# EasyEDA Pro project 六轴机械臂.eprj

# Schematic 拓展板

## Sheets
1 控制: Board Name: 拓展板; Create Date: 2025-06-17; Page Name: 控制; Project Name: 六轴机械臂; Schematic Name: 拓展板; Update Date: 2025-06-18; Add into BOM: yes; Company: 嘉立创EDA; Convert to PCB: yes; Page Size: A4; Version: V1.0
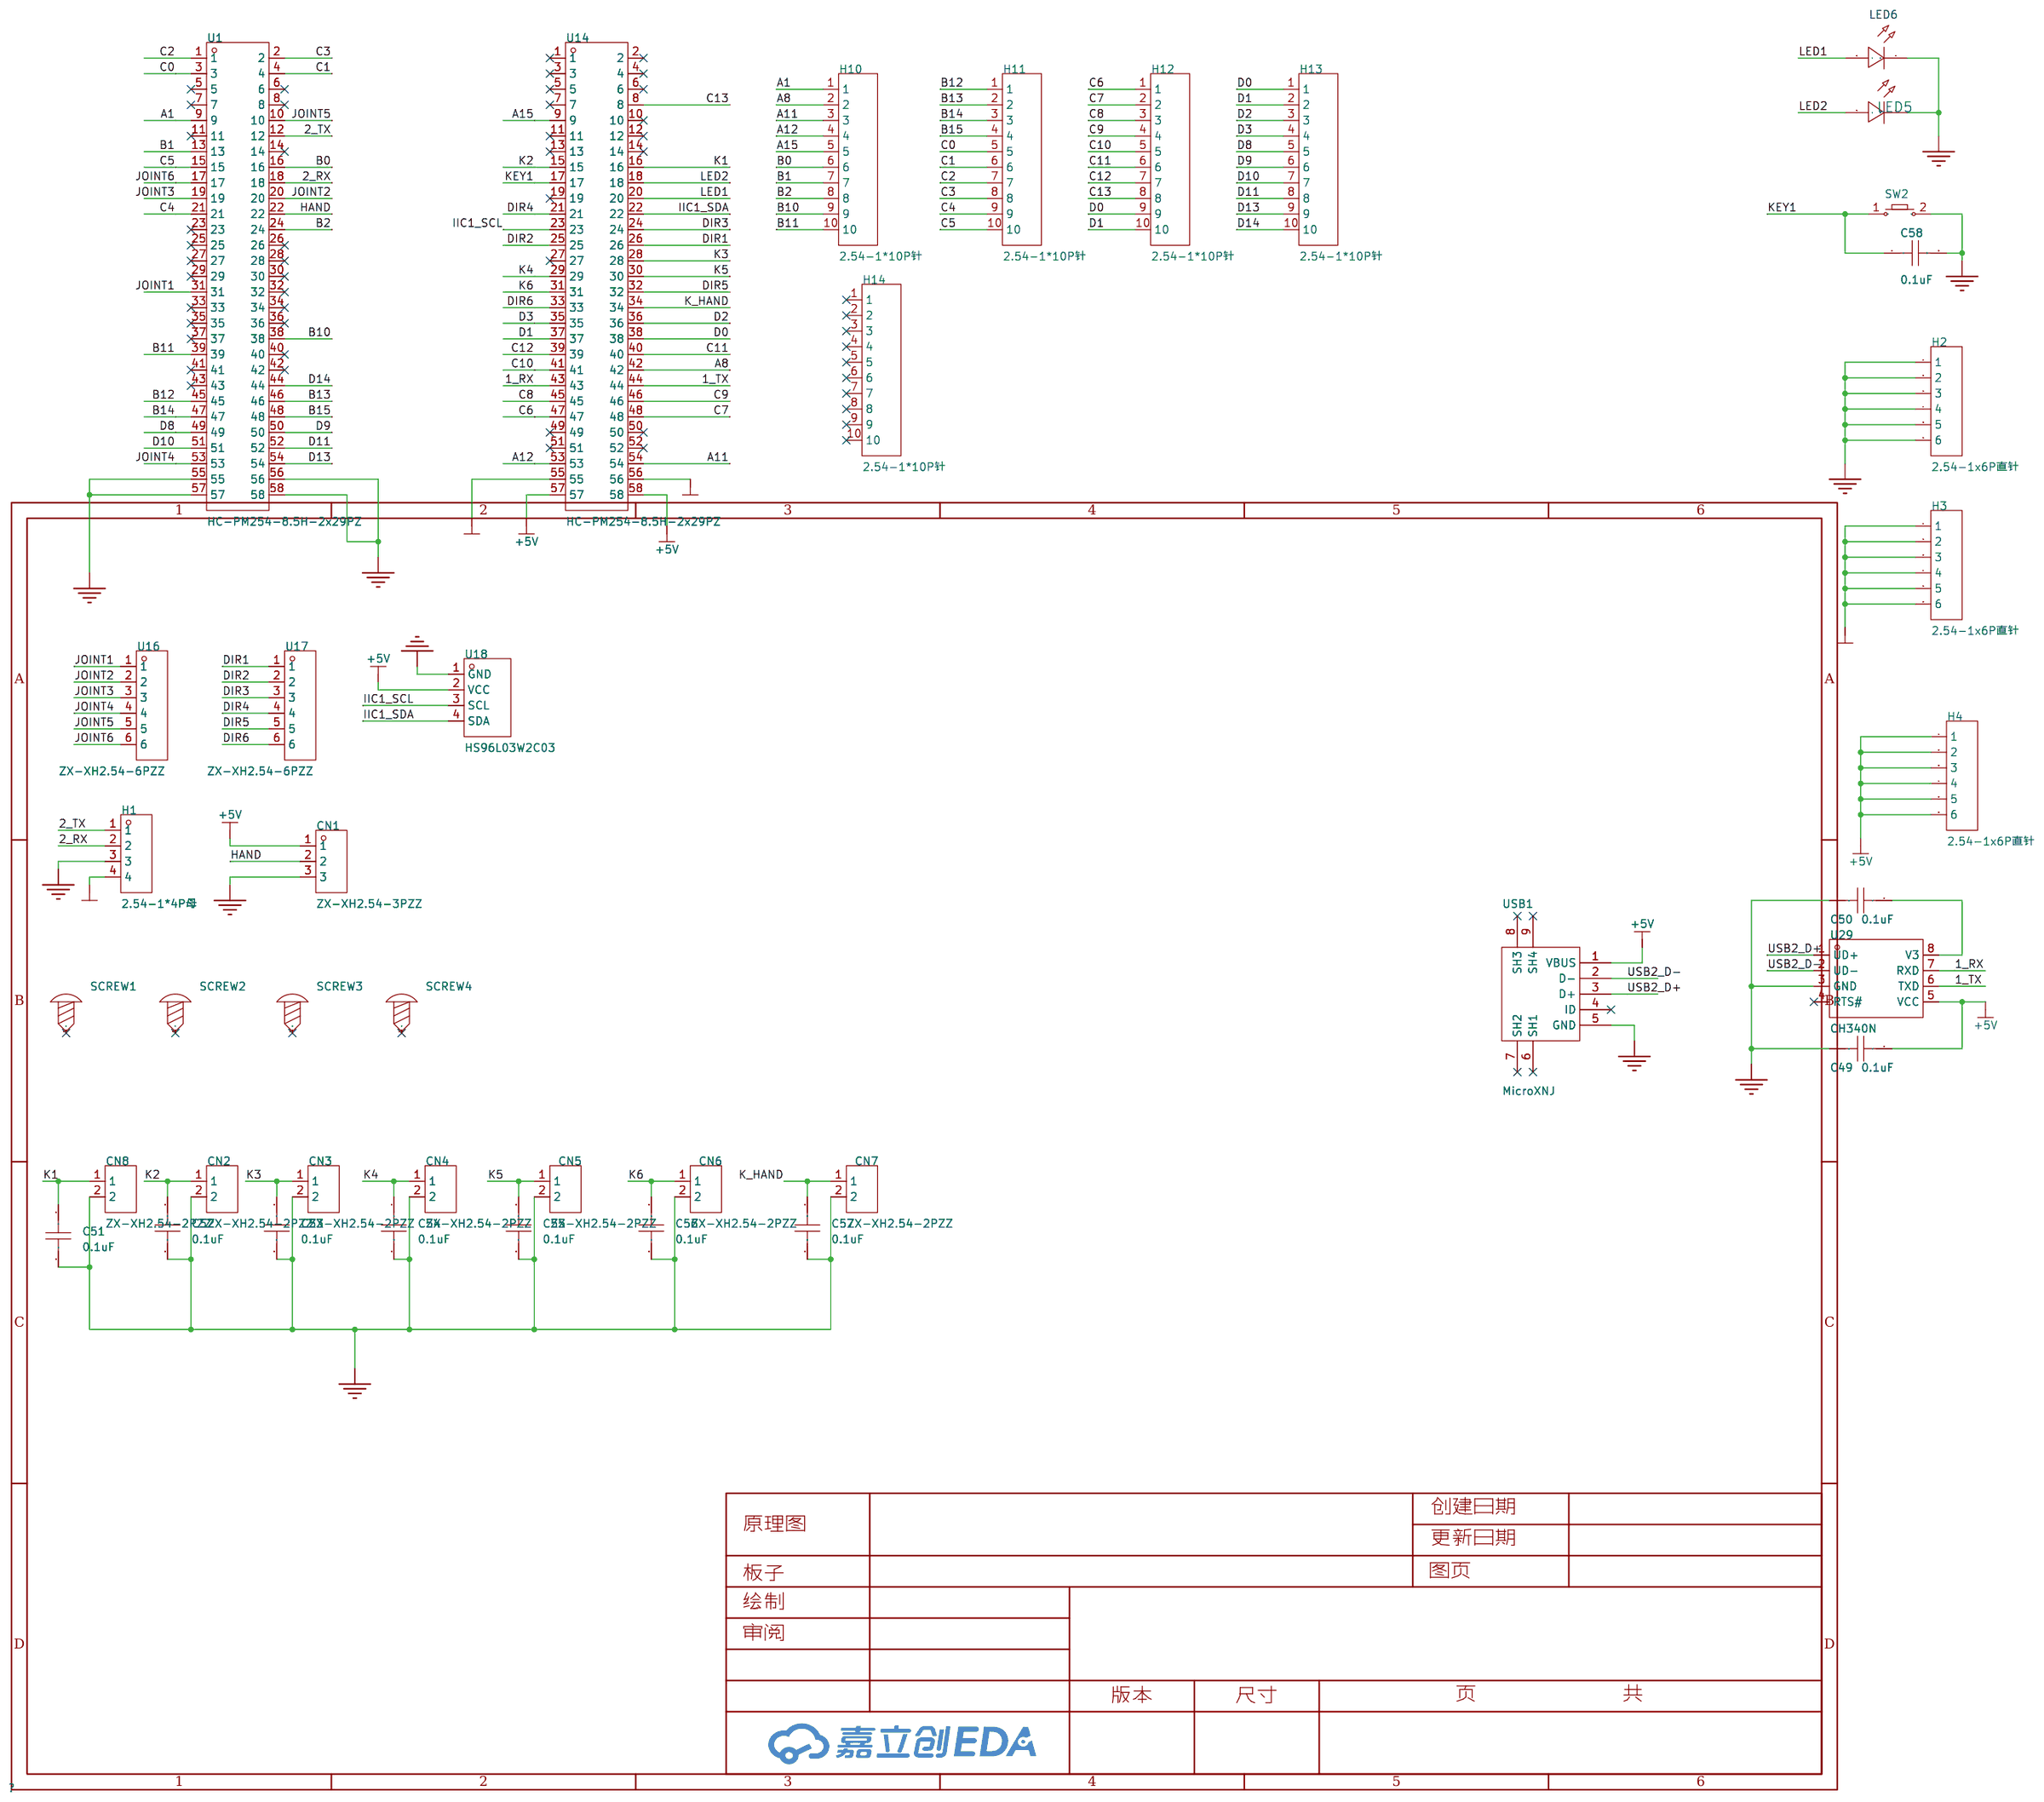
[diagram p0: 控制]
2 电源: Page Name: 电源; Update Date: 2025-06-17
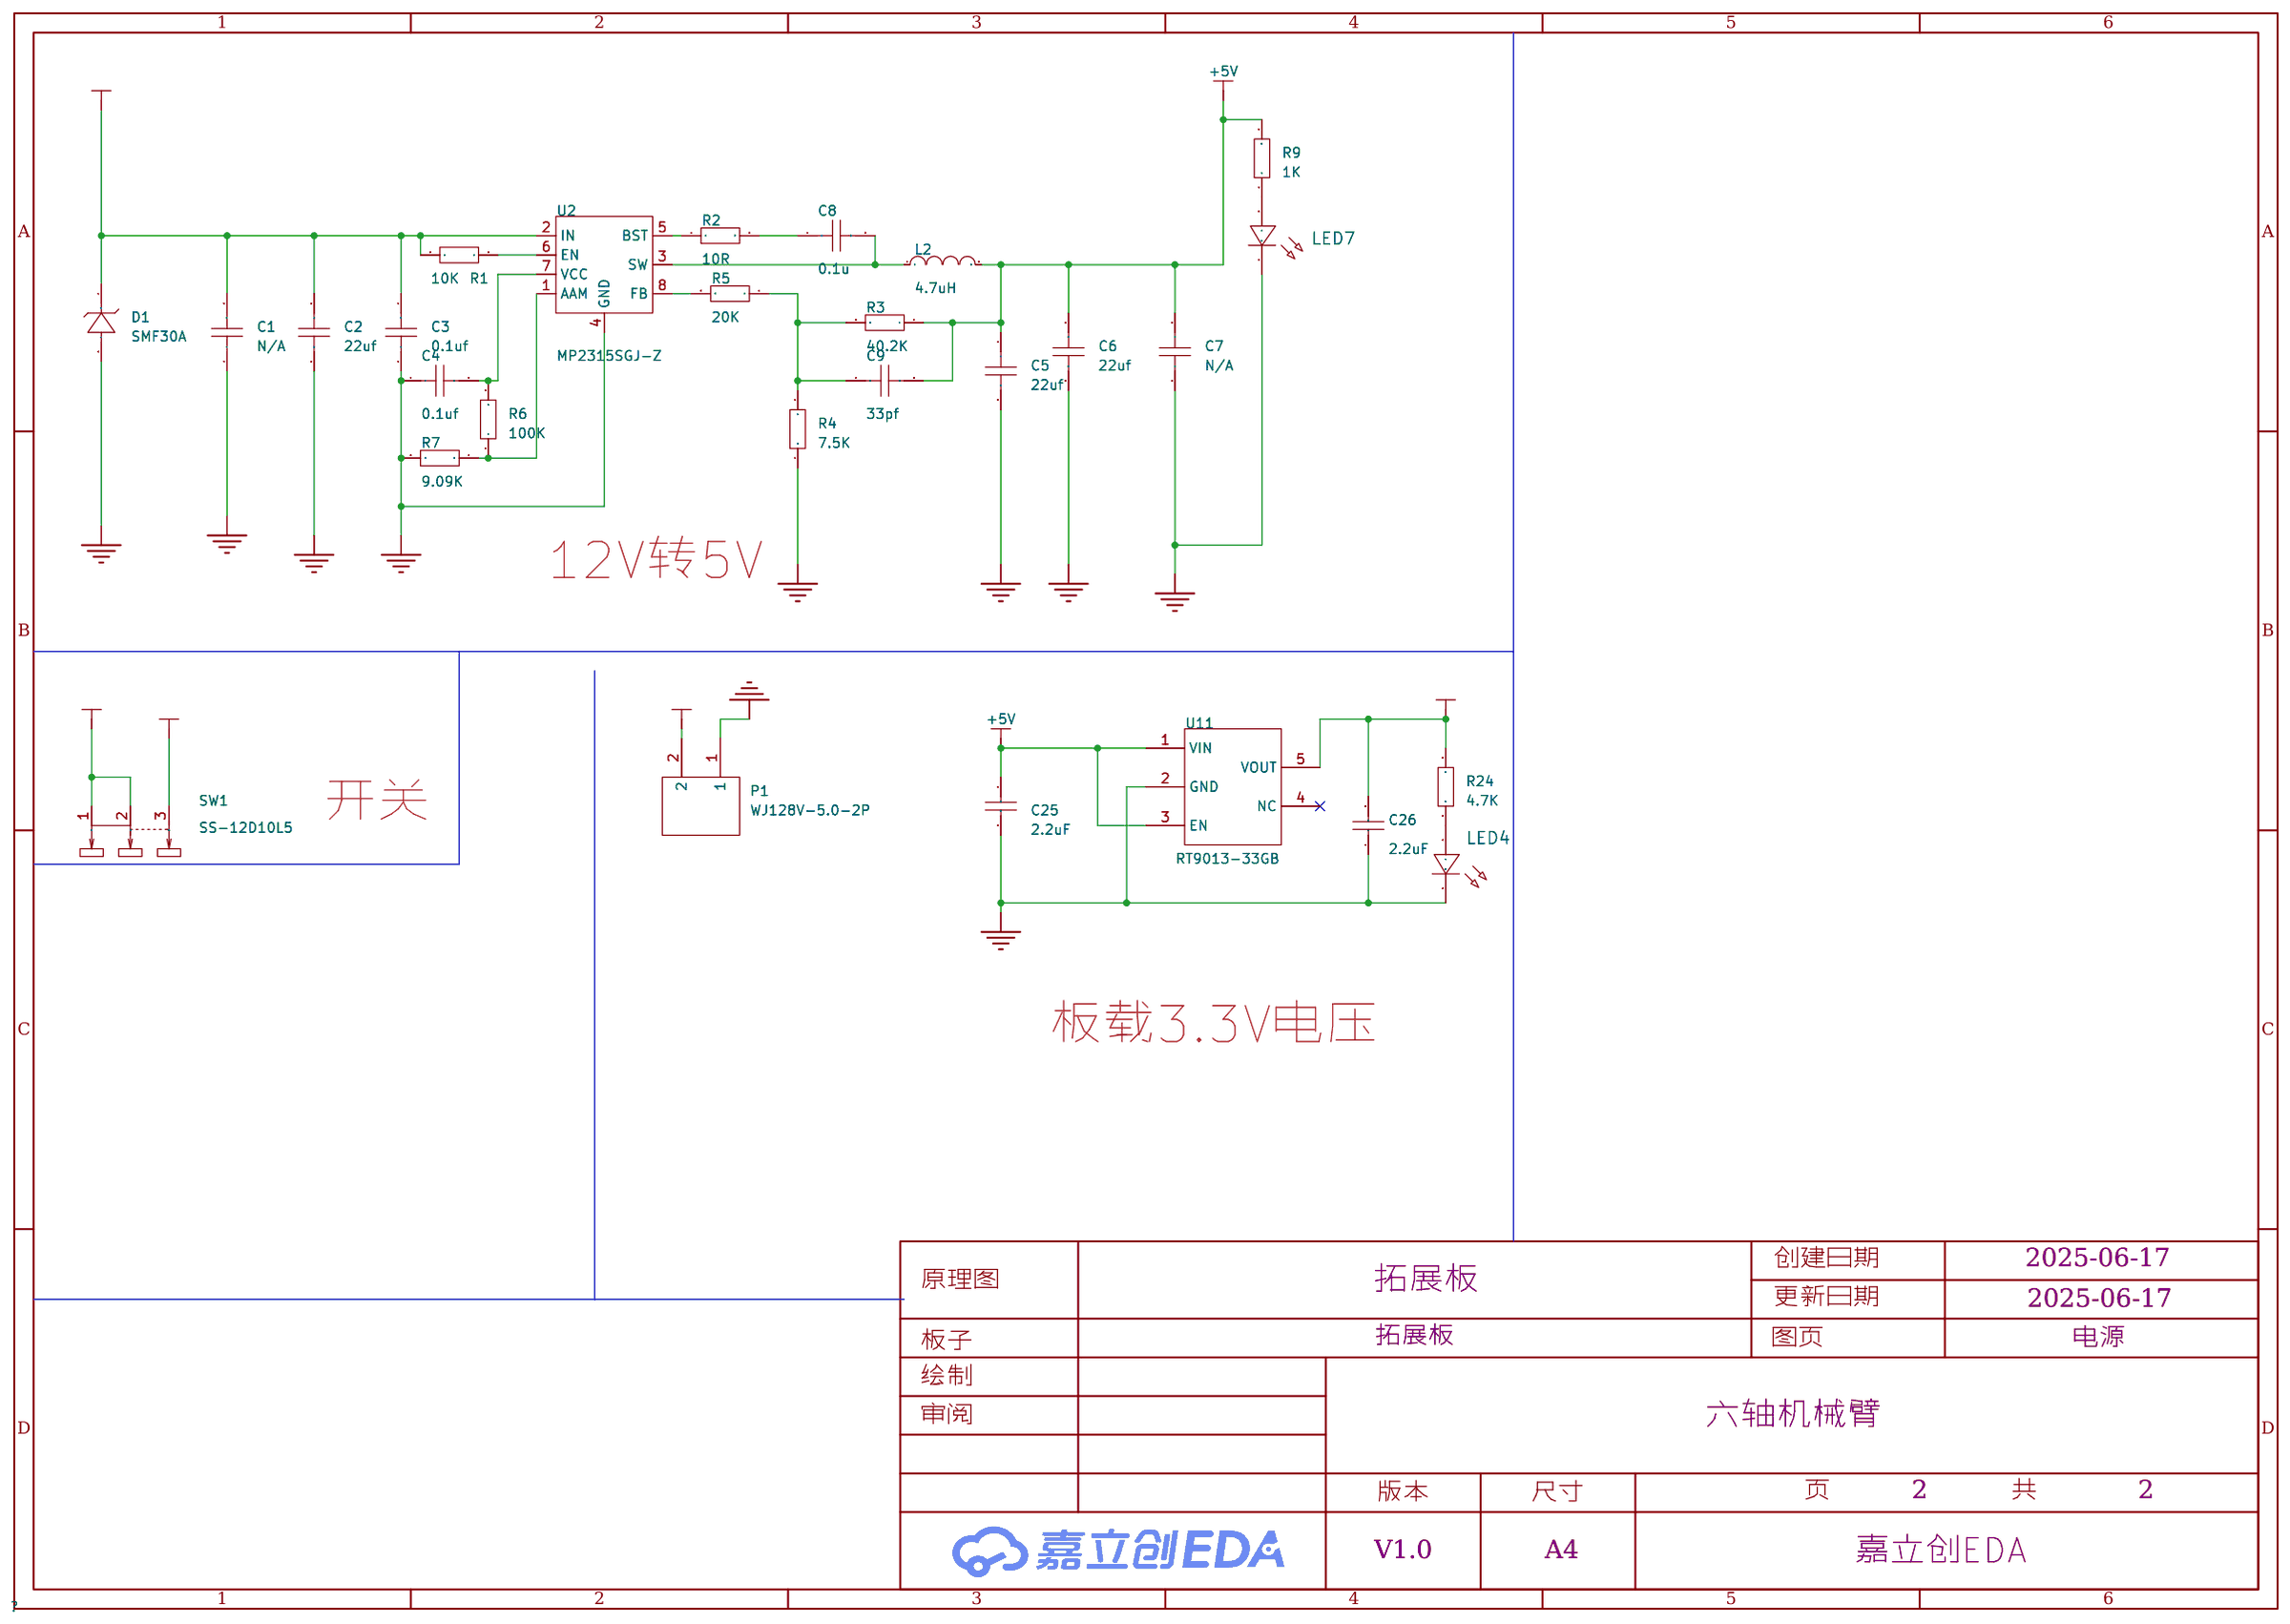
[diagram p1: 电源]

## Parts
sheet 控制
C49  0.1uF  [C0603]
C50  0.1uF  [C0603]
C51  0.1uF  [C0603]
C52  0.1uF  [C0603]
C53  0.1uF  [C0603]
C54  0.1uF  [C0603]
C55  0.1uF  [C0603]
C56  0.1uF  [C0603]
C57  0.1uF  [C0603]
C58  0.1uF  [C0603]
CN1  ZX-XH2.54-3PZZ  [CONN-TH_3P-P2.54_2501S-3P]
CN2  ZX-XH2.54-2PZZ  [CONN-TH_2P-P2.50_HX25003-2A]
CN3  ZX-XH2.54-2PZZ  [CONN-TH_2P-P2.50_HX25003-2A]
CN4  ZX-XH2.54-2PZZ  [CONN-TH_2P-P2.50_HX25003-2A]
CN5  ZX-XH2.54-2PZZ  [CONN-TH_2P-P2.50_HX25003-2A]
CN6  ZX-XH2.54-2PZZ  [CONN-TH_2P-P2.50_HX25003-2A]
CN7  ZX-XH2.54-2PZZ  [CONN-TH_2P-P2.50_HX25003-2A]
CN8  ZX-XH2.54-2PZZ  [CONN-TH_2P-P2.50_HX25003-2A]
H1  2.54-1*4P母  [HDR-TH_4P-P2.54-V-F]
H2  2.54-1x6P直针  [HDR-TH_6P-P2.54-V-M-1]
H3  2.54-1x6P直针  [HDR-TH_6P-P2.54-V-M-1]
H4  2.54-1x6P直针  [HDR-TH_6P-P2.54-V-M-1]
H10  2.54-1*10P针  [HDR-TH_10P-P2.54-V-M-1]
H11  2.54-1*10P针  [HDR-TH_10P-P2.54-V-M-1]
H12  2.54-1*10P针  [HDR-TH_10P-P2.54-V-M-1]
H13  2.54-1*10P针  [HDR-TH_10P-P2.54-V-M-1]
H14  2.54-1*10P针  [HDR-TH_10P-P2.54-V-M-1]
LED5  -  [LED_0603]
LED6  -  [LED_0603]
SCREW1  -  [M2螺丝]
SCREW2  -  [M2螺丝]
SCREW3  -  [M2螺丝]
SCREW4  -  [M2螺丝]
SW2  -  [Key_SMD_3x4x2]
U1  HC-PM254-8.5H-2x29PZ  [HDR-TH_58P-P2.54-V-F-R2-C29-S2.54]
U14  HC-PM254-8.5H-2x29PZ  [HDR-TH_58P-P2.54-V-F-R2-C29-S2.54]
U16  ZX-XH2.54-6PZZ  [CONN-TH_6P-P2.50_ZX-XH2.54-6PZZ]
U17  ZX-XH2.54-6PZZ  [CONN-TH_6P-P2.50_ZX-XH2.54-6PZZ]
U18  HS96L03W2C03  [OLED-TH_L27.8-W27.2-P2.54_C9900033791]
U29  CH340N  [SOP-8_L4.9-W3.9-P1.27-LS6.0-BL]
USB1  MicroXNJ  [MICRO-USB-SMD_MICROXNJ]
sheet 电源
C1  N/A  [C0603]
C2  22uf  [C0603]
C3  0.1uf  [C0603]
C4  0.1uf  [C0603]
C5  22uf  [C0603]
C6  22uf  [C0603]
C7  N/A  [C0603]
C8  0.1u  [C0603]
C9  33pf  [C0603]
C25  2.2uF  [C0603]
C26  2.2uF  [C0603]
D1  SMF30A  [SOD-123FL_L2.7-W1.8-LS3.8-RD]
L2  4.7uH  [IND-SMD_L5.4-W5.2_FXL0530]
LED4  -  [LED_0603]
LED7  -  [LED_0603]
P1  WJ128V-5.0-2P  [CONN-TH_2P-P5.00_WJ128V-5.0-2P]
R1  10K  [R0603]
R2  10R  [R0603]
R3  40.2K  [R0603]
R4  7.5K  [R0603]
R5  20K  [R0603]
R6  100K  [R0603]
R7  9.09K  [R0603]
R9  1K  [R0603]
R24  4.7K  [R0603]
SW1  SS-12D10L5  [SW-TH_SS-12D10L5]
U2  MP2315SGJ-Z  [TSOT-23-8_L2.9-W1.6-P0.65-LS2.8-BL]
U11  RT9013-33GB  [SOT-23-5_L3.0-W1.7-P0.95-LS2.8-BL]

## Library data of the parts
C1-C9 C49-C58 = CAP_0603: Supplier Footprint: 0603
CN1 = ZX-XH2.54-3PZZ: LCSC Part Name: 1x3P 间距:2.5mm 直插 系列:XH; Supplier Part: C7429633; Manufacturer: Megastar(兆星); Supplier Footprint: 插件,P=2.5mm; JLCPCB Part Class: 扩展库; Datasheet: https://atta.szlcsc.com/upload/public/pdf/source/20230619/AE17037A2CFDBE8D9CBA775D61AD0A84.pdf; Supplier: LCSC; Pins Structure: 1x3P; Pitch: 2.5mm; Mounting Type: 直插; Reference Series: XH; Number of Pins: 3P; Number of Rows: 1; Number of PINs Per Row: 3; Rated Current: 3A; Contact Material: 黄铜; Contact Plating: 锡; Operating Temperature: -25℃~+85℃; Rated Voltage (Max): 250V; Plastic Material: PA66; Flame Retardant Rating: UL94V-0; Color: 白色; Z-Height of the Board: 7mm; X-Length of Bottom Edge on Board (Spacing Line): 10mm; Y-Width of Bottom Edge on Board: 5.9mm
CN2-CN8 = ZX-XH2.54-2PZZ: LCSC Part Name: 1x2P 间距:2.5mm 直插 系列:XH; Supplier Part: C7429632; Manufacturer: Megastar(兆星); Supplier Footprint: 插件,P=2.5mm; JLCPCB Part Class: 扩展库; Datasheet: https://atta.szlcsc.com/upload/public/pdf/source/20230619/19BA6947230AA44A04D3EDD65E618FD0.pdf; Supplier: LCSC; Pins Structure: 1x2P; Pitch: 2.5mm; Mounting Type: 直插; Reference Series: XH; Number of Pins: 2P; Number of Rows: 1; Number of PINs Per Row: 2; Rated Current: 3A; Contact Material: 黄铜; Contact Plating: 锡; Operating Temperature: -25℃~+85℃; Rated Voltage (Max): 250V; Plastic Material: PA66; Flame Retardant Rating: UL94V-0; Color: 白色; Z-Height of the Board: 7mm; X-Length of Bottom Edge on Board (Spacing Line): 7.5mm; Y-Width of Bottom Edge on Board: 5.9mm
H1 = 2.54-1*4P母: LCSC Part Name: 间距:2.54mm 1x4P 直插; Supplier Part: C2718488; Manufacturer: BOOMELE(博穆精密); Supplier Footprint: 插件,P=2.54mm; JLCPCB Part Class: 扩展库; Datasheet: https://atta.szlcsc.com/upload/public/pdf/source/20210301/C2718488_F4427B881E42CAA8DDB0B1C12B3A522C.pdf; Supplier: LCSC; Holes Structure: 1x4P; Pitch: 2.54mm; Circular Hole / Square Hole: 方孔; Mounting Type: 直插; Number of Rows: 单排; Number of Holes: 4P; Current Rating (Max): 3A; Holes Direction: 顶部; Contact Material: 青铜; Operating Temperature Range: -40℃~+105℃
H2-H4 = 2.54-1x6P直针: LCSC Part Name: 1x6P 间距:2.54mm 方针 直插; Supplier Part: C37208; Manufacturer: BOOMELE(博穆精密); Supplier Footprint: 插件,P=2.54mm; JLCPCB Part Class: 扩展库; Datasheet: https://atta.szlcsc.com/upload/public/pdf/source/20250115/42A019761A40C8B839643401D8CA5A96.pdf; Supplier: LCSC; Pin Structure: 1x6P; Pitch: 2.54mm; Circluar Pins/Square Pins: 方针; Mounting Type: 直插; Number of Rows: 单排; Number of Pins: 6P; Current Rating: 3A; Contact Material: 黄铜; Operating Temperature: -40℃~+105℃; Color: 黑色
H10-H14 = 2.54-1*10P针: LCSC Part Name: 1x10P 间距:2.54mm 方针 直插; Supplier Part: C57369; Manufacturer: BOOMELE(博穆精密); Supplier Footprint: 插件,P=2.54mm; JLCPCB Part Class: 扩展库; Datasheet: https://atta.szlcsc.com/upload/public/pdf/source/20151109/1457707572883.pdf; Supplier: LCSC; Pin Structure: 1x10P; Pitch: 2.54mm; Circluar Pins/Square Pins: 方针; Mounting Type: 直插; Number of Rows: 单排; Number of Pins: 10P; Current Rating: 3A; Operating Temperature: -40℃~+105℃; Color: 黑色
LED4 LED5 LED7 = LED_0603-R: Supplier Footprint: 0603
LED6 = LED_0603-G: Supplier Footprint: 0603
SCREW1-SCREW4 = M2螺丝: Supplier Footprint: 插件
SW2 = Key_SMD_3x4x2: Supplier Footprint: SMD
U1 U14 = HC-PM254-8.5H-2x29PZ: LCSC Part Name: 间距2.54mm 2x29Pin 直插 PC3.0 H8.5; Supplier Part: C41376169; Manufacturer: HC(虹成电子); Supplier Footprint: 插件,P=2.54mm; Datasheet: https://atta.szlcsc.com/upload/public/pdf/source/20250106/4E42E502EF17F4DFEB61B7A0CE1BBEC6.pdf; Supplier: LCSC; Holes Structure: 2x29P; Pitch: 2.54mm; Row Spacing: 2.54mm; Circular Hole / Square Hole: 方孔; Mounting Type: 直插; Number of Rows: 双排; Number of Positions: 58P; Current Rating: 3A; Holes Direction: 顶部; Insulation Height: 8.5mm; Contact Material: 黄铜; Contact Plating: 金; Operating Temperature: -40℃~+105℃; PIN Length: 3mm
U16 U17 = ZX-XH2.54-6PZZ: LCSC Part Name: 1x6P 间距:2.5mm 直插 系列:XH; Supplier Part: C7429636; Manufacturer: Megastar(兆星); Supplier Footprint: 插件,P=2.5mm; JLCPCB Part Class: 扩展库; Datasheet: https://atta.szlcsc.com/upload/public/pdf/source/20230619/1243AD0A516E39CD3D274D8985780568.pdf; Supplier: LCSC; Pins Structure: 1x6P; Pitch: 2.5mm; Mounting Type: 直插; Reference Series: XH; Number of Pins: 6P; Number of Rows: 1; Number of PINs Per Row: 6; Rated Current: 3A; Contact Material: 黄铜; Contact Plating: 锡; Operating Temperature: -25℃~+85℃; Rated Voltage (Max): 250V; Plastic Material: PA66; Flame Retardant Rating: UL94V-0; Color: 白色; Z-Height of the Board: 7mm; X-Length of Bottom Edge on Board (Spacing Line): 17.5mm; Y-Width of Bottom Edge on Board: 5.9mm
U18 = HS96L03W2C03: LCSC Part Name: 0.96寸OLED显示屏窄白光IIC; Supplier Part: C5248080; Manufacturer: HS(汉昇); JLCPCB Part Class: 扩展库; Datasheet: https://atta.szlcsc.com/upload/public/pdf/source/20230627/763D01F79A90007632F098068C7C8AD9.pdf; Supplier: LCSC; Main Control Chip: SSD1315; Interface Type: I2C; Size: 0.96; Pixel Resolution: 128x64; Operating Temperature: -40℃~+70℃
U29 = CH340N: 应用功能:USB转串口;接口协议:USB 2.0;通道数:1;数据速率:2Mbps;; LCSC Part Name: USB2.0芯片CH340; Supplier Part: C2977777; Manufacturer: WCH(南京沁恒); Supplier Footprint: SOP-8; JLCPCB Part Class: Extended Part; Datasheet: https://atta.szlcsc.com/upload/public/pdf/source/20240313/115CDE92081B1D6CB446704AD5D0F5F2.pdf; Supplier: LCSC; Applications Function: USB转串口; Protocol: USB 2.0; Number of Channels: 1; Voltage - Supply: 3.3V；5V; Data Rate: 2Mbps; Operating Temperature: -20℃~+70℃
USB1 = MicroXNJ: LCSC Part Name: Micro-B 母 卧贴; Supplier Part: C404969; Manufacturer: SHOU HAN(首韩); Supplier Footprint: SMD; JLCPCB Part Class: 扩展库; Datasheet: https://atta.szlcsc.com/upload/public/pdf/source/20220415/2494EDFF499AF6F852F7C820374B6AF3.pdf; Supplier: LCSC; Connector Type: Micro-B; Standard: USB 2.0; Gender: 母; Mounting Style: 卧贴; Number of Contacts: 5P; Number of Ports: 1; Current Rating - Power (Max): 1.8A; Operating Temperature Range: -20℃~+85℃; Rated Voltage (Max): 30V; Connect-Disconnect Life: 5千次; Core Colour: 黑色
C25 C26 = 0603B104K500NT: 容值:100nF;精度:±10%;额定电压:50V;材质(温度系数):X7R;; LCSC Part Name: 100nF ±10% 50V; Supplier Part: C30926; Manufacturer: FH(风华); Supplier Footprint: 0603; JLCPCB Part Class: 扩展库; Datasheet: https://atta.szlcsc.com/upload/public/pdf/source/20170923/C30926_1506149436298988724.pdf; Supplier: LCSC; Tolerance: ±10%; Voltage Rated: 50V; Temperature Coefficient: X7R
D1 = SMF30A: 极性:单向;反向截止电压(Vrwm):30V;击穿电压(最小值):33.3V;击穿电压(最大值):36.8V;反向漏电流(Ir):1μA;峰值脉冲电流(Ipp)@10/1000μs:4.1A;最大钳位电压:48.4V;峰值脉冲功率(Ppp)@10/1000μs:200W;; LCSC Part Name: 单向 30V 200W; Supplier Part: C353290; Manufacturer: 晶导微电子; Supplier Footprint: SOD-123FL; JLCPCB Part Class: Extended Part; Datasheet: https://atta.szlcsc.com/upload/public/pdf/source/20201106/C438024_76561727B84E8C9F41A4B4461A8AA838.pdf; Supplier: LCSC; Polarity: 单向; Reverse Stand-Off Voltage (Vrwm): 30V; Breakdown Voltage (Min): 33.3V; Breakdown Voltage (Max): 36.8V; Reverse Leakage Current (Ir): 1μA; Peak Pulse Current (Ipp)@10/1000μs: 4.1A; Maximum Clamping Voltage: 48.4V; Peak Pulse Power Dissipation (Ppp)@10/1000μs: 200W
L2 = FXL0530-4R7-M: LCSC Part Name: 4.7uH ±20% 5A; Supplier Part: C177246; Manufacturer: cjiang(长江微电); Supplier Footprint: SMD,5.2x5.4mm; JLCPCB Part Class: Extended Part; Datasheet: https://atta.szlcsc.com/upload/public/pdf/source/20240426/3189EA8206330E2108542F9E34E540E7.pdf; Supplier: LCSC; Tolerance: ±20%; Rated Current: 4.5A; Saturation Current (Isat): 5A; DC Resistance (DCR): 60mΩ; Type: 一体成型电感
P1 = WJ128V-5.0-2P: 结构:1x2P;间距:5mm;颜色:绿色;安装方式:直插;额定电流:20A;额定电压:250V;排数:1;线规 - AWG:12~22;线规 - 平方毫米:2.5;每排PIN数:2;工作温度范围:-40℃~+105℃;; LCSC Part Name: 5mm 1x2P 排数:1 每排P数:2 直插; Supplier Part: C8269; Manufacturer: KANGNEX(康奈克斯电气); Supplier Footprint: 插件,P=5mm; JLCPCB Part Class: 扩展库; Datasheet: https://atta.szlcsc.com/upload/public/pdf/source/20191225/C8269_1FF44D6D2E83DB14A7CA266A410FD9AD.pdf; Supplier: LCSC; Structure: 1x2P; Pitch: 5mm; Color: 绿色; Mounting Style: 直插; Current Rating (Max): 20A; Voltage Rating (Max): 250V; Number of Pins: 2P; Number of Rows: 1; Wire Gauge - AWG: 12~22; Wire Gauge - mm2: 2.5; Number of PINs Per Row: 2; Operating Temperature Range: -40℃~+105℃
R1-R7 R9 R24 = Res_0603: Supplier Footprint: 0603
SW1 = SS-12D10L5: 电路结构:单刀双掷;安装方式:直插;开关颜色:黑色;额定电流(DC):3A;额定电压(DC):125V;额定电流(AC):3A;额定电压(AC):125V;机械寿命:1万次;; LCSC Part Name: 柄长5mm 直插双档 滑动开关; Supplier Part: C319012; Manufacturer: XKB Connectivity(中国星坤); Supplier Footprint: 插件; JLCPCB Part Class: 扩展库; Datasheet: https://atta.szlcsc.com/upload/public/pdf/source/20211009/D6412F37AABE6F9459A6EE7FA4DAEADB.pdf; Supplier: LCSC; Circuit: 单刀双掷; Actuator Style: 矩形柱状; Pin Style: PC引脚; Switch Length: 13mm; Switch Width: 6.8mm; Switch Height: 6.4mm; Mounting Style: 直插; Actuator Color: 黑色; Current Rating (DC): 3A; Voltage Rating (DC): 125V; Current Rating (AC): 3A; Voltage Rating (AC): 125V; Mechanical Life: 1万次; Operating Temperature: -40℃~+85℃
U2 = MP2315SGJ-Z: 功能类型:降压型;输出类型:固定;工作电压:4.5V~24V;输出电压:800mV~22.8V;输出电流:3A;; LCSC Part Name: 3A、24V、500kHz高效同步降压转换器; Supplier Part: C3031493; Manufacturer: MPS(芯源); Supplier Footprint: TSOT-23-8; JLCPCB Part Class: 扩展库; Datasheet: https://atta.szlcsc.com/upload/public/pdf/source/20250306/6947E43CF096EA5EF0087E1884EF0D8F.pdf; Supplier: LCSC; Function: 降压型; Output Type: 固定; Voltage - Supply: 4.5V~24V; Output Voltage: 800mV~22.8V; Output Current: 3A; Frequency - Switching: 500kHz; Operating Temperature: -40℃~+125℃; Synchronous Rectifier: 是; Number of Outputs: 1; Topology: 降压式; Quiescent Current: 120uA; Switch tube (built-in/external): 内置
U11 = RT9013-33GB: 输出类型:固定;最大输入电压:5.5V;输出电压:3.3V;输出电流:500mA;电源纹波抑制比(PSRR):50dB@(10kHz);输出极性:正极;; LCSC Part Name: 输入5.5V 输出3.3V 500mA; Supplier Part: C47773; Manufacturer: RICHTEK(立锜); Supplier Footprint: SOT-23-5; JLCPCB Part Class: Extended Part; Datasheet: https://atta.szlcsc.com/upload/public/pdf/source/20150504/1457707282459.pdf; Supplier: LCSC; Output Type: 固定; Output Polarity: 正极; Number of Outputs: 1; Maximum Input Voltage: 5.5V; Output Voltage: 3.3V; Dropout Voltage: 400mV@(500mA); Quiescent Current (Ground Current): 50uA; Output Current: 500mA; Power Supply Rejection Ratio (PSRR): 50dB@(10kHz); Feature: 低ESR；防静电保护；热保护(TSD)；过流保护(OCP)；带使能; Operating Temperature: -40℃~+85℃; standby current: 50uA

## Nets
3.3V: C26.2 H1.4 H3.1 H3.2 H3.3 H3.4 H3.5 H3.6 R24.2 U11.5(VOUT) U14.55 U14.56
12V_IN: P1.2 SW1.3
12V_OUT: C1.2 C2.1 C3.1 D1.1(K) R1.1 SW1.1 SW1.2 U2.2(IN)
+5V: C5.1 C6.1 C7.1 C9.2 C25.2 C49.1 CN1.1 H4.1 H4.2 H4.3 H4.4 H4.5 H4.6 L2.2 R3.1 R9.2 U11.1(VIN) U11.3(EN) U14.57 U14.58 U18.2(VCC) U29.5(VCC) USB1.1(VBUS)
GND: C1.1 C2.2 C3.2 C4.1 C5.2 C6.2 C7.2 C25.1 C26.1 C49.2 C50.2 C51.2 C52.2 C53.2 C54.2 C55.2 C56.2 C57.2 C58.2 CN1.3 CN2.2 CN3.2 CN4.2 CN5.2 CN6.2 CN7.2 CN8.2 D1.2(A) H1.3 H2.1 H2.2 H2.3 H2.4 H2.5 H2.6 LED4.1(C) LED5.1(C) LED6.1(C) LED7.1(C) P1.1 R4.1 R7.2 SW2.2 U1.55 U1.56 U1.57 U1.58 U2.4(GND) U11.2(GND) U18.1(GND) U29.3(GND) USB1.5(GND)
1_RX: U14.43 U29.7(RXD)
1_TX: U14.44 U29.6(TXD)
2_RX: H1.2 U1.18
2_TX: H1.1 U1.12
A1: H10.1 U1.9
A8: H10.2 U14.42
A11: H10.3 U14.54
A12: H10.4 U14.53
A15: H10.5 U14.9
B0: H10.6 U1.16
B1: H10.7 U1.13
B2: H10.8 U1.24
B10: H10.9 U1.38
B11: H10.10 U1.39
B12: H11.1 U1.45
B13: H11.2 U1.46
B14: H11.3 U1.47
B15: H11.4 U1.48
C0: H11.5 U1.3
C1: H11.6 U1.4
C2: H11.7 U1.1
C3: H11.8 U1.2
C4: H11.9 U1.21
C5: H11.10 U1.15
C6: H12.1 U14.47
C7: H12.2 U14.48
C8: H12.3 U14.45
C9: H12.4 U14.46
C10: H12.5 U14.41
C11: H12.6 U14.40
C12: H12.7 U14.39
C13: H12.8 U14.8
D0: H12.9 H13.1 U14.38
D1: H12.10 H13.2 U14.37
D2: H13.3 U14.36
D3: H13.4 U14.35
D8: H13.5 U1.49
D9: H13.6 U1.50
D10: H13.7 U1.51
D11: H13.8 U1.52
D13: H13.9 U1.54
D14: H13.10 U1.44
DIR1: U14.26 U17.1
DIR2: U14.25 U17.2
DIR3: U14.24 U17.3
DIR4: U14.21 U17.4
DIR5: U14.32 U17.5
DIR6: U14.33 U17.6
HAND: CN1.2 U1.22
IIC1_SCL: U14.23 U18.3(SCL)
IIC1_SDA: U14.22 U18.4(SDA)
JOINT1: U1.31 U16.1
JOINT2: U1.20 U16.2
JOINT3: U1.19 U16.3
JOINT4: U1.53 U16.4
JOINT5: U1.10 U16.5
JOINT6: U1.17 U16.6
K1: C51.1 CN8.1 U14.16
K2: C52.1 CN2.1 U14.15
K3: C53.1 CN3.1 U14.28
K4: C54.1 CN4.1 U14.29
K5: C55.1 CN5.1 U14.30
K6: C56.1 CN6.1 U14.31
K_HAND: C57.1 CN7.1 U14.34
KEY1: C58.1 SW2.1 U14.17
LED1: LED6.2(A) U14.20
LED2: LED5.2(A) U14.18
USB2_D+: U29.1(UD+) USB1.3(D+)
USB2_D-: U29.2(UD-) USB1.2(D-)
$1N3596: C50.1 U29.8(V3)
$2N769: R1.2 U2.6(EN)
$2N774: C4.2 R6.2 U2.7(VCC)
$2N775: C8.2 L2.1 U2.3(SW)
$2N780: R2.1 U2.5(BST)
$2N781: C8.1 R2.2
$2N783: R5.2 U2.8(FB)
$2N784: C9.1 R3.2 R4.2 R5.1
$2N785: R6.1 R7.1 U2.1(AAM)
$2N1147: LED4.2(A) R24.1
$2N2263: LED7.2(A) R9.1

Not connected (* = marked no-connect by the designer): H14 1* 2* 3* 4* 5* 6* 7* 8* 9* 10*; SCREW1 1*; SCREW2 1*; SCREW3 1*; SCREW4 1*; U1 5* 6* 7* 8* 11* 14* 23* 25* 26* 27* 28* 29* 30* 32* 33* 34* 35* 36* 37* 40* 41* 42* 43*; U11 4(NC)*; U14 1* 2* 3* 4* 5* 6* 7* 10* 11* 12* 13* 14* 19* 27* 49* 50* 51* 52*; U29 4(RTS#)*; USB1 4(ID)* 6(SH1)* 7(SH2)* 8(SH3)* 9(SH4)*

## Notes on the sheets
sheet 2
- 12V转5V
- 开关
- 板载3.3V电压

# Board 拓展板
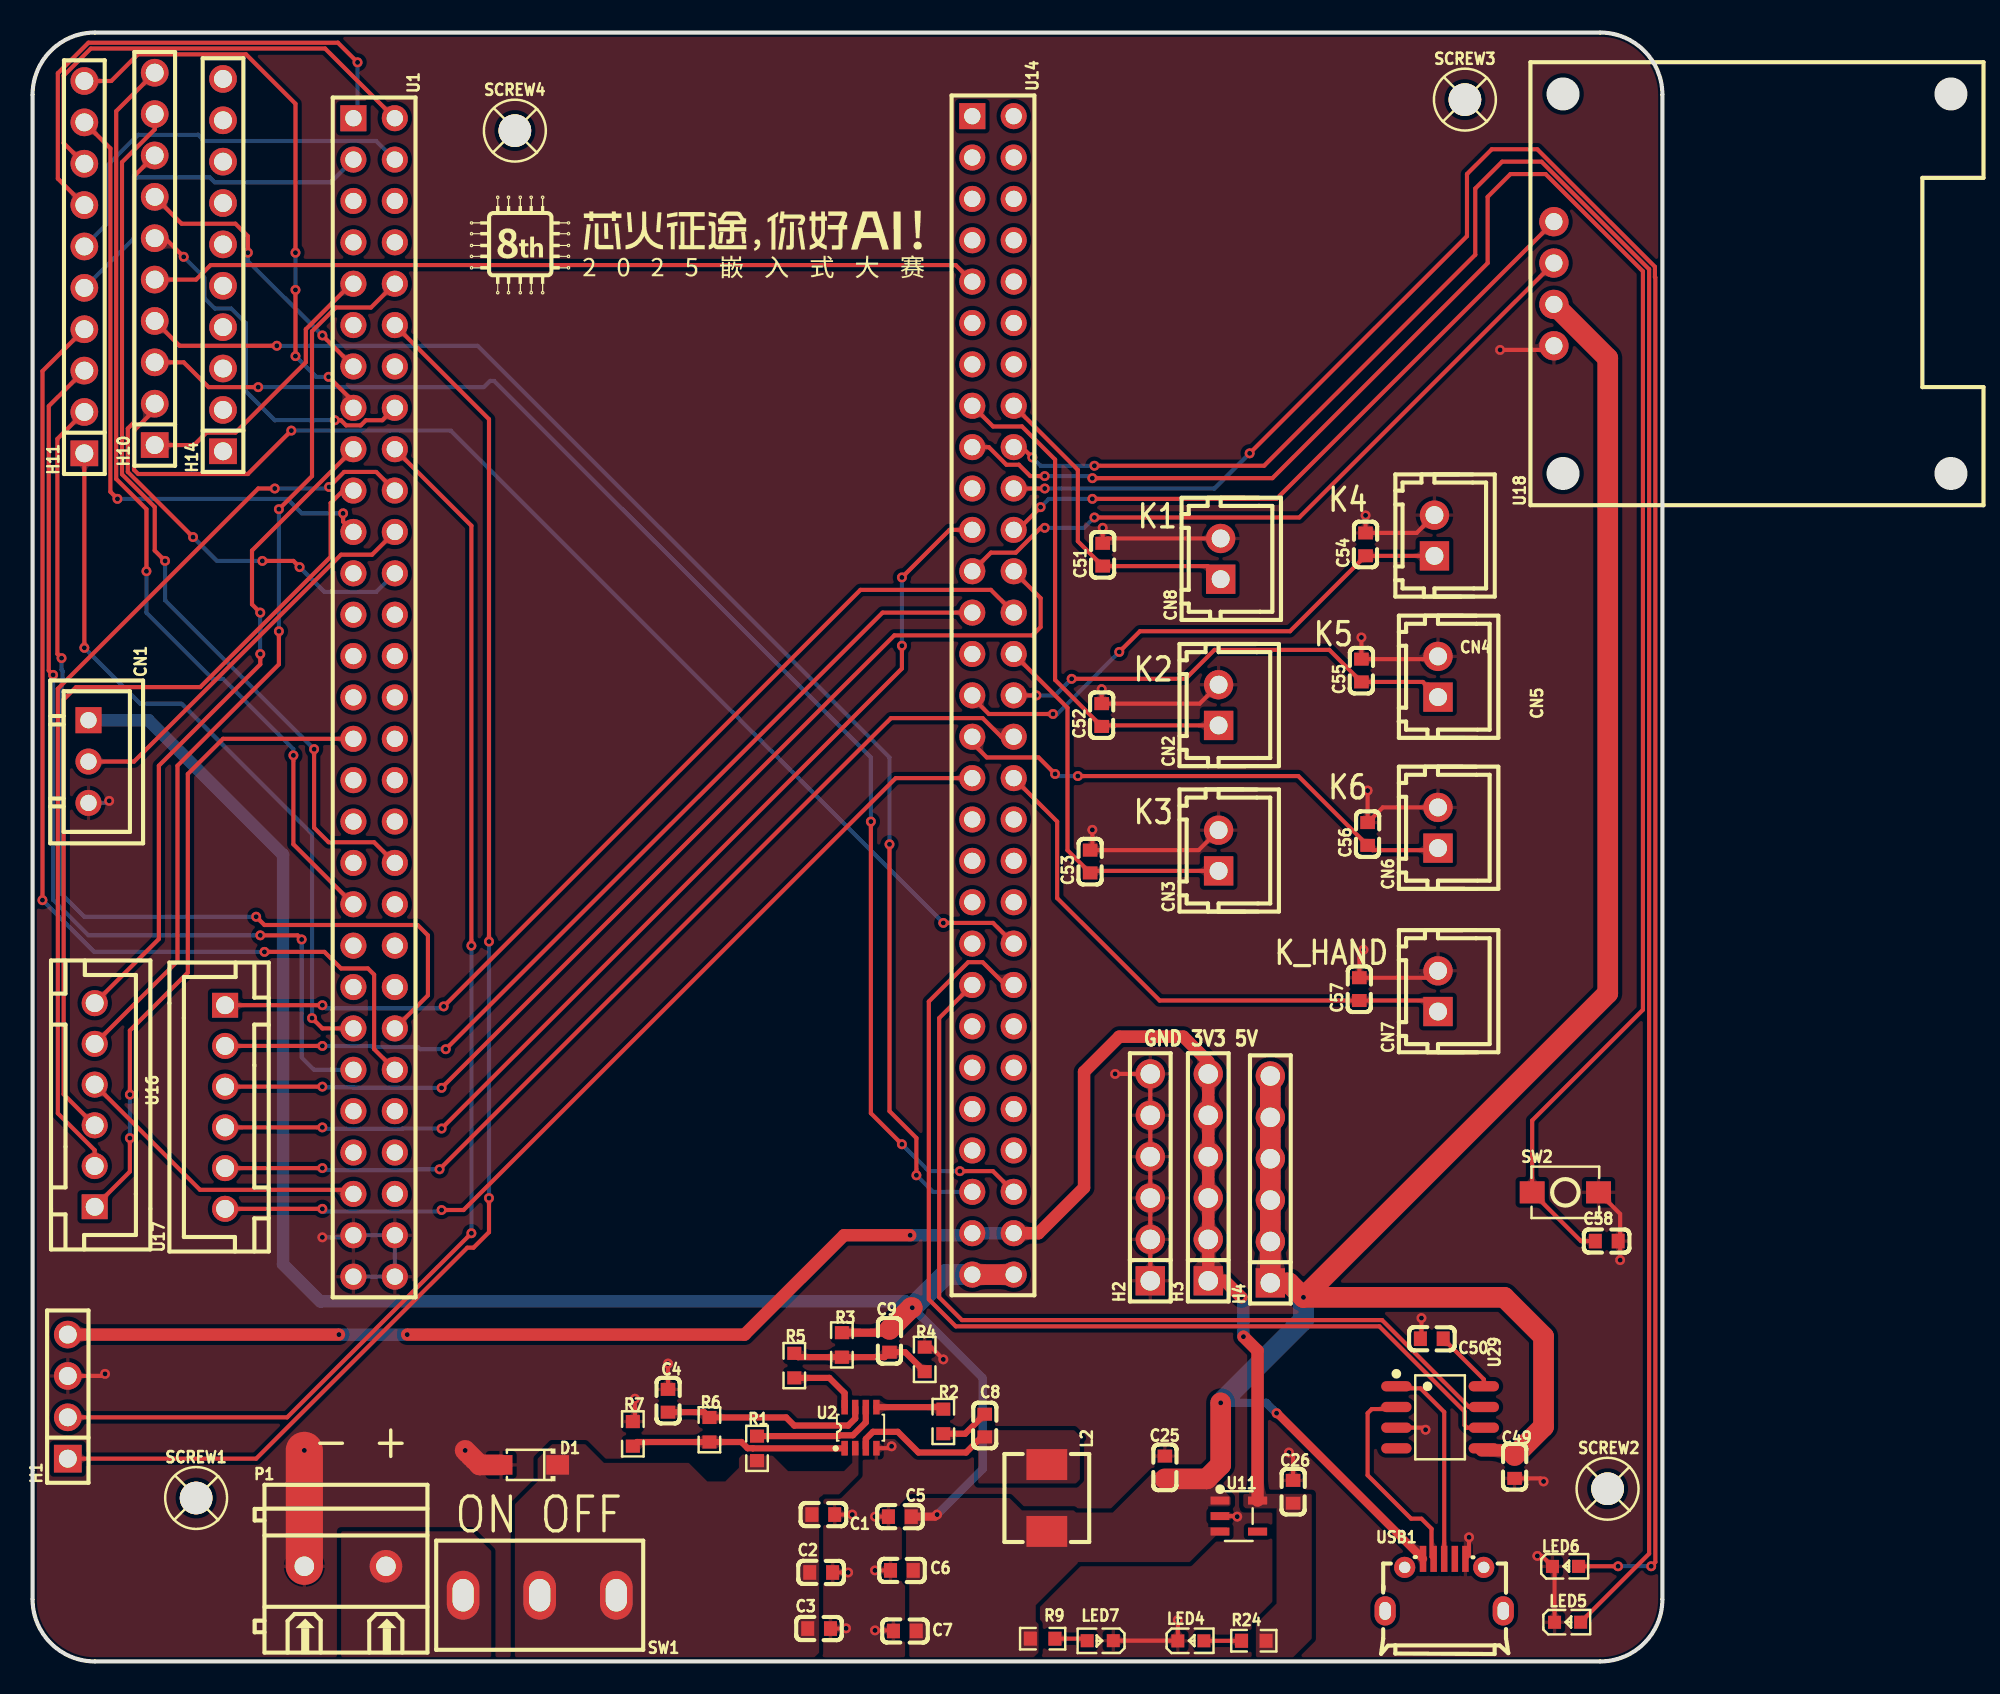
[diagram p2: board, top side]
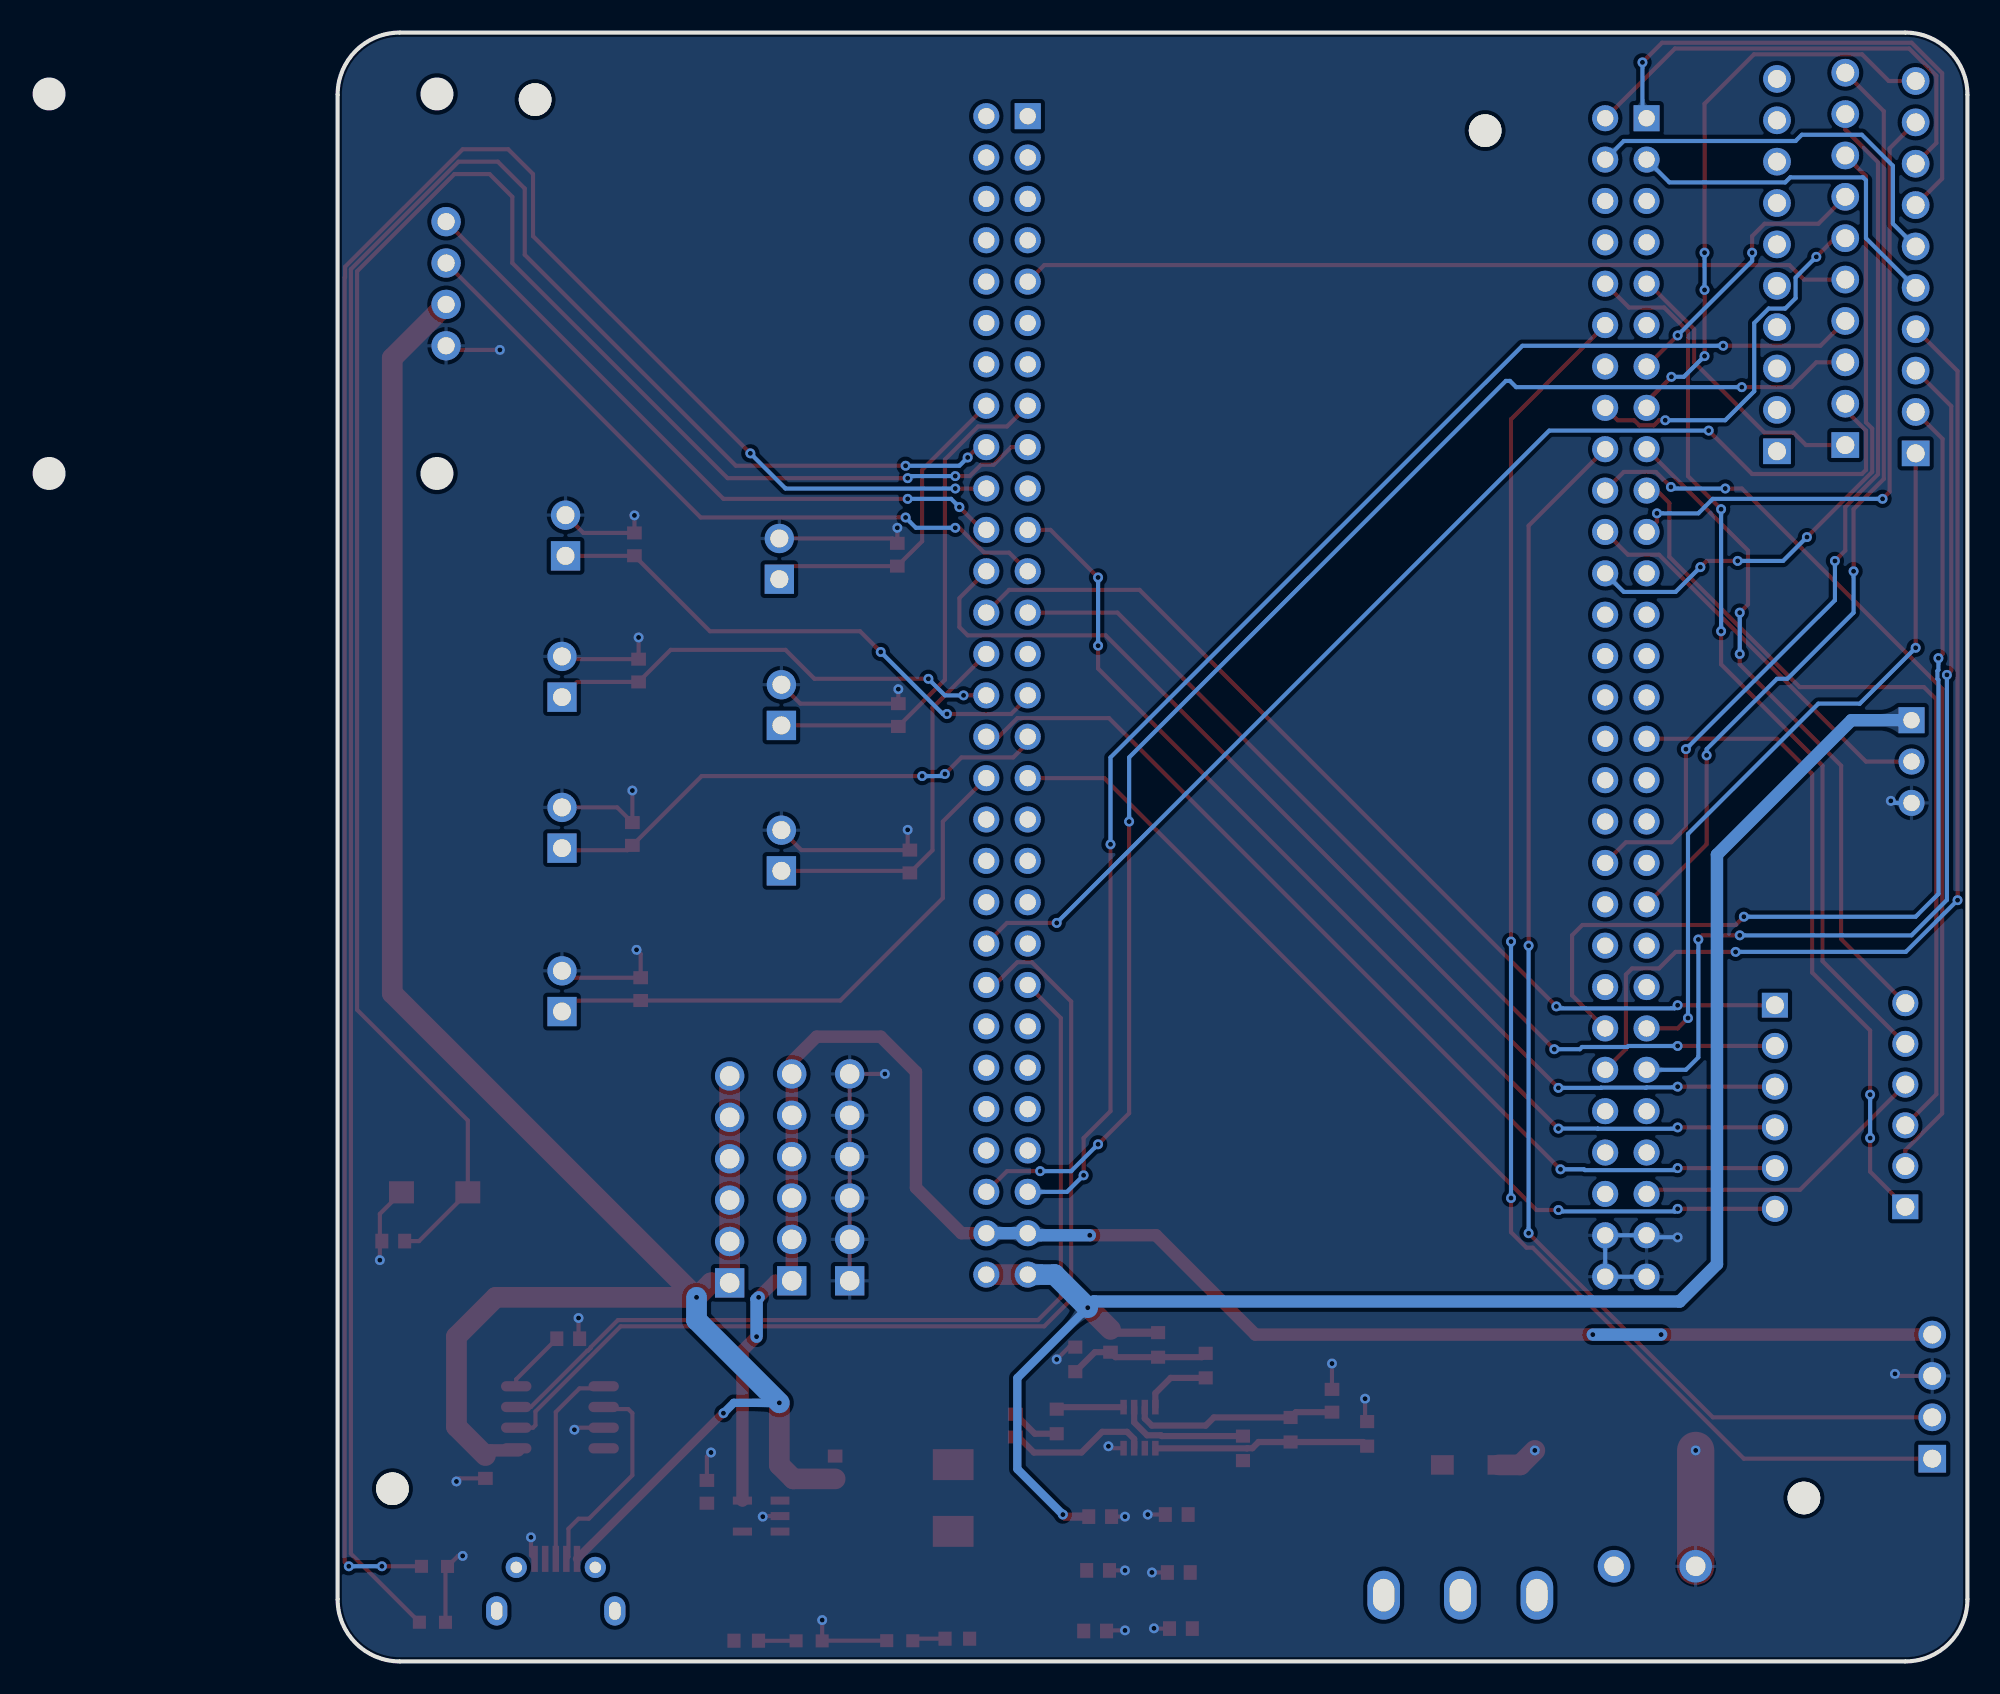
[diagram p3: board, bottom side, seen from below]

Outline 118.72 x 100 mm; copper layers: Top Layer, Bottom Layer. Coordinates in mm from the lower left corner of the outline.
Outline path: 0,96.19 0,3.81 arc(1.12,1.12) 3.81,0 96.19,0 arc(98.88,1.12) 100,3.81 100,96.19 arc(98.88,98.88) 96.19,100 3.81,100 arc(1.12,98.88) 0,96.19
Stack: Top Layer 0.035mm / Dielectric1 1.51mm FR4 er 4.5 / Bottom Layer 0.035mm

## Design rules (mm)
net USB2_D+: DP1
net USB2_D-: DP1
template: 自定义配置
spacing copperThickness1oz (default): track to track 0.102, other pairs 0.152 to 0.3
spacing copperThickness2oz: track to track 0.203, other pairs 0.152 to 0.3
track width copperThickness1oz (default): min 0.127, default 0.254, max 2.54
track width copperThickness2oz: min 0.203, default 0.254, max 2.54
differential pair differentialPair (default): width min 0.127, default 0.254, max 2.54; gap min 0.152, default 0.152
via viaSize (default): diameter min 0.5, default 0.61, max 10; hole min 0.3, default 0.305, max 6.3
net 12V_OUT uses 导线
net +5V uses 导线
net $2N775 uses 导线
net 3.3V uses 导线
net 12V_IN uses 导线

## Placement (name value [footprint] x y rotation side)
C1  N/A  [C0603]  48.51 9.02 180 top
C2  22uf  [C0603]  48.39 5.46 0 top
C3  0.1uf  [C0603]  48.26 2.02 0 top
C4  0.1uf  [C0603]  38.99 16 270 top
C5  22uf  [C0603]  53.21 8.89 180 top
C6  22uf  [C0603]  53.34 5.59 180 top
C7  N/A  [C0603]  53.52 1.87 180 top
C8  0.1u  [C0603]  58.42 14.48 270 top
C9  33pf  [C0603]  52.58 19.69 90 top
C25  2.2uF  [C0603]  69.47 11.91 270 top
C26  2.2uF  [C0603]  77.34 10.41 270 top
C49  0.1uF  [C0603]  90.93 11.94 270 top
C50  0.1uF  [C0603]  85.85 19.81 180 top
C51  0.1uF  [C0603]  65.66 67.94 90 top
C52  0.1uF  [C0603]  65.6 58.1 90 top
C53  0.1uF  [C0603]  64.89 49.11 90 top
C54  0.1uF  [C0603]  81.79 68.58 90 top
C55  0.1uF  [C0603]  81.53 60.83 90 top
C56  0.1uF  [C0603]  81.91 50.8 90 top
C57  0.1uF  [C0603]  81.41 41.28 90 top
C58  0.1uF  [C0603]  96.59 25.81 0 top
CN1  ZX-XH2.54-3PZZ  [CONN-TH_3P-P2.54_2501S-3P]  3.43 55.25 270 top
CN2  ZX-XH2.54-2PZZ  [CONN-TH_2P-P2.50_HX25003-2A]  72.77 58.71 90 top
CN3  ZX-XH2.54-2PZZ  [CONN-TH_2P-P2.50_HX25003-2A]  72.77 49.78 90 top
CN4  ZX-XH2.54-2PZZ  [CONN-TH_2P-P2.50_HX25003-2A]  86.01 69.12 90 top
CN5  ZX-XH2.54-2PZZ  [CONN-TH_2P-P2.50_HX25003-2A]  86.23 60.45 90 top
CN6  ZX-XH2.54-2PZZ  [CONN-TH_2P-P2.50_HX25003-2A]  86.23 51.18 90 top
CN7  ZX-XH2.54-2PZZ  [CONN-TH_2P-P2.50_HX25003-2A]  86.23 41.15 90 top
CN8  ZX-XH2.54-2PZZ  [CONN-TH_2P-P2.50_HX25003-2A]  72.9 67.69 90 top
D1  SMF30A  [SOD-123FL_L2.7-W1.8-LS3.8-RD]  30.48 12.06 180 top
H1  2.54-1*4P母  [HDR-TH_4P-P2.54-V-F]  2.16 16.26 90 top
H2  2.54-1x6P直针  [HDR-TH_6P-P2.54-V-M-1]  68.58 29.72 90 top
H3  2.54-1x6P直针  [HDR-TH_6P-P2.54-V-M-1]  72.14 29.72 90 top
H4  2.54-1x6P直针  [HDR-TH_6P-P2.54-V-M-1]  75.95 29.59 90 top
H10  2.54-1*10P针  [HDR-TH_10P-P2.54-V-M-1]  7.49 86.11 90 top
H11  2.54-1*10P针  [HDR-TH_10P-P2.54-V-M-1]  3.17 85.6 90 top
H14  2.54-1*10P针  [HDR-TH_10P-P2.54-V-M-1]  11.68 85.72 90 top
L2  4.7uH  [IND-SMD_L5.4-W5.2_FXL0530]  62.23 10.03 270 top
LED4  -  [LED_0603]  71.12 1.27 0 top
LED5  -  [LED_0603]  94.23 2.41 0 top
LED6  -  [LED_0603]  94.11 5.84 0 top
LED7  -  [LED_0603]  65.46 1.26 180 top
P1  WJ128V-5.0-2P  [CONN-TH_2P-P5.00_WJ128V-5.0-2P]  19.18 5.84 0 top
R1  10K  [R0603]  44.45 13.08 90 top
R2  10R  [R0603]  55.88 14.73 270 top
R3  40.2K  [R0603]  49.66 19.43 270 top
R4  7.5K  [R0603]  54.74 18.54 270 top
R5  20K  [R0603]  46.74 18.16 270 top
R6  100K  [R0603]  41.53 14.22 90 top
R7  9.09K  [R0603]  36.83 13.97 90 top
R9  1K  [R0603]  61.98 1.4 180 top
R24  4.7K  [R0603]  74.93 1.27 0 top
SCREW1  -  [M2螺丝]  10.03 10.03 0 top
SCREW2  -  [M2螺丝]  96.64 10.6 0 top
SCREW3  -  [M2螺丝]  87.88 95.89 0 top
SCREW4  -  [M2螺丝]  29.59 93.98 0 top
SW1  SS-12D10L5  [SW-TH_SS-12D10L5]  31.11 4.06 180 top
SW2  -  [Key_SMD_3x4x2]  94.05 28.8 0 top
U1  HC-PM254-8.5H-2x29PZ  [HDR-TH_58P-P2.54-V-F-R2-C29-S2.54]  20.95 59.18 270 top
U2  MP2315SGJ-Z  [TSOT-23-8_L2.9-W1.6-P0.65-LS2.8-BL]  50.8 14.35 0 top
U11  RT9013-33GB  [SOT-23-5_L3.0-W1.7-P0.95-LS2.8-BL]  74.01 8.92 270 top
U14  HC-PM254-8.5H-2x29PZ  [HDR-TH_58P-P2.54-V-F-R2-C29-S2.54]  58.93 59.31 270 top
U16  ZX-XH2.54-6PZZ  [CONN-TH_6P-P2.50_ZX-XH2.54-6PZZ]  3.81 34.16 270 top
U17  ZX-XH2.54-6PZZ  [CONN-TH_6P-P2.50_ZX-XH2.54-6PZZ]  11.81 34.04 90 top
U18  HS96L03W2C03  [OLED-TH_L27.8-W27.2-P2.54_C9900033791]  93.34 84.58 90 top
U29  CH340N  [SOP-8_L4.9-W3.9-P1.27-LS6.0-BL]  86.36 14.99 270 top
USB1  MicroXNJ  [MICRO-USB-SMD_MICROXNJ]  86.61 4.7 0 top

## Footprints (pads in the part's own frame, mm; a bottom-side part is the same pattern mirrored in y, then rotated)
C0603
  rect 0.8x0.9 smd: 1(-0.7,0) 2(0.7,0)
CONN-TH_2P-P2.50_HX25003-2A
  rect 1.8x1.8 hole 1.1: 1(-1.25,0)
  round 1.8 hole 1.1: 2(1.25,0)
CONN-TH_2P-P5.00_WJ128V-5.0-2P
  round 2 hole 1.2: 1(-2.505,0) 2(2.505,0)
CONN-TH_3P-P2.54_2501S-3P
  rect 1.6x1.6 hole 1: 1(-2.54,0)
  round 1.6 hole 1: 2(0,0) 3(2.54,0)
CONN-TH_6P-P2.50_ZX-XH2.54-6PZZ
  rect 1.524x1.6 hole 1.1: 1(6.25,0)
  round 1.6 hole 1.1: 2(3.75,0) 3(1.25,0) 4(-1.25,0) 5(-3.75,0) 6(-6.25,0)
HDR-TH_4P-P2.54-V-F
  rect 1.7x1.7 hole 1.1: 1(-3.81,0)
  round 1.7 hole 1.1: 2(-1.27,0) 3(1.27,0) 4(3.81,0)
HDR-TH_6P-P2.54-V-M-1
  rect 1.8x1.8 hole 1.2: 1(-6.35,0)
  round 1.8 hole 1.2: 2(-3.81,0) 3(-1.27,0) 4(1.27,0) 5(3.81,0) 6(6.35,0)
HDR-TH_10P-P2.54-V-M-1
  rect 1.575x1.7 hole 1.1: 1(-11.43,0)
  round 1.7 hole 1.1: 2(-8.89,0) 3(-6.35,0) 4(-3.81,0) 5(-1.27,0) 6(1.27,0) 7(3.81,0) 8(6.35,0) 9(8.89,0) 10(11.43,0)
HDR-TH_58P-P2.54-V-F-R2-C29-S2.54
  rect 1.6x1.6 hole 1: 1(-35.56,-1.27)
  round 1.6 hole 1: 2(-35.56,1.27) 3(-33.02,-1.27) 4(-33.02,1.27) 5(-30.48,-1.27) 6(-30.48,1.27) 7(-27.94,-1.27) 8(-27.94,1.27) 9(-25.4,-1.27) 10(-25.4,1.27) 11(-22.86,-1.27) 12(-22.86,1.27) 13(-20.32,-1.27) 14(-20.32,1.27) 15(-17.78,-1.27) 16(-17.78,1.27) 17(-15.24,-1.27) 18(-15.24,1.27) 19(-12.7,-1.27) 20(-12.7,1.27) 21(-10.16,-1.27) 22(-10.16,1.27) 23(-7.62,-1.27) 24(-7.62,1.27) 25(-5.08,-1.27) 26(-5.08,1.27) 27(-2.54,-1.27) 28(-2.54,1.27) 29(0,-1.27) 30(0,1.27) 31(2.54,-1.27) 32(2.54,1.27) 33(5.08,-1.27) 34(5.08,1.27) 35(7.62,-1.27) 36(7.62,1.27) 37(10.16,-1.27) 38(10.16,1.27) 39(12.7,-1.27) 40(12.7,1.27) 41(15.24,-1.27) 42(15.24,1.27) 43(17.78,-1.27) 44(17.78,1.27) 45(20.32,-1.27) 46(20.32,1.27) 47(22.86,-1.27) 48(22.86,1.27) 49(25.4,-1.27) 50(25.4,1.27) 51(27.94,-1.27) 52(27.94,1.27) 53(30.48,-1.27) 54(30.48,1.27) 55(33.02,-1.27) 56(33.02,1.27) 57(35.56,-1.27) 58(35.56,1.27)
IND-SMD_L5.4-W5.2_FXL0530
  rect 1.9x2.5 smd: 1(-2.05,0) 2(2.05,0)
Key_SMD_3x4x2
  rect 1.53x1.36 smd: 1(-2.035,0) 2(2.035,0)
LED_0603
  rect 0.8x0.8 smd: 1(-0.851,-0.01) 2(0.75,-0.005)
M2螺丝
  round 2 hole 2: 1(0,0)
MICRO-USB-SMD_MICROXNJ
  rect 0.4x1.6 smd: 1(-1.3,1.597) 2(-0.65,1.597) 3(0,1.597) 4(0.65,1.597) 5(1.3,1.597)
  round 1.3 hole 0.7: 6(2.425,1.074) 9(-2.425,1.073)
  oval 1.3x1.8 hole 0.7x1.1: 7(3.625,-1.597) 8(-3.625,-1.597)
OLED-TH_L27.8-W27.2-P2.54_C9900033791
  round 1.8 hole 1.05: 1(-3.81,0) 2(-1.27,0) 3(1.27,0) 4(3.81,0)
R0603
  rect 0.806x0.864 smd: 1(-0.753,0) 2(0.753,0)
SOD-123FL_L2.7-W1.8-LS3.8-RD
  rect 1.399x1.199 smd: 1(-1.735,0) 2(1.735,0)
SOP-8_L4.9-W3.9-P1.27-LS6.0-BL
  oval 0.63x1.865 smd: 1(-1.905,-2.683) 2(-0.635,-2.683) 3(0.635,-2.683) 4(1.905,-2.683) 5(1.905,2.683) 6(0.635,2.683) 7(-0.635,2.683) 8(-1.905,2.683)
SOT-23-5_L3.0-W1.7-P0.95-LS2.8-BL
  rect 0.49x1.157 smd: 1(-0.95,-1.153) 2(0,-1.153) 3(0.95,-1.153)
  rect 0.49x1.175 smd: 4(0.95,1.153) 5(-0.95,1.153)
SW-TH_SS-12D10L5
  oval 2x3 hole 1.3x2: 1(-4.7,0) 2(0,0) 3(4.7,0)
TSOT-23-8_L2.9-W1.6-P0.65-LS2.8-BL
  rect 0.4x0.9 smd: 1(-0.975,-1.26) 2(-0.325,-1.26) 3(0.325,-1.26) 4(0.975,-1.26) 5(0.975,1.26) 6(0.325,1.26) 7(-0.325,1.26) 8(-0.975,1.26)

## Nets
As in the schematic.

Pads without a net: H14 1 2 3 4 5 6 7 8 9 10; SCREW1 1; SCREW2 1; SCREW3 1; SCREW4 1; U1 5 6 7 8 11 14 23 25 26 27 28 29 30 32 33 34 35 36 37 40 41 42 43; U11 4; U14 1 2 3 4 5 6 7 10 11 12 13 14 19 27 49 50 51 52; U29 4; USB1 4 6 7 8 9

## Via types
v1: diameter 0.61, hole 0.305, Top Layer to Bottom Layer, 123 vias

## Routing (per net, layer and track width the routed paths; a pad name or vN(x,y) marks a point on that pad's centre or on a via; arc(x,y) is an arc through that point)
3.3V: length 111.2
  Top Layer w0.762: H1.4 v1(18.8,20.07) ; U11.5 75.16,19.07 v1(74.29,19.94) ; v1(53.85,26.16) 49.78,26.16 43.69,20.07 v1(22.99,20.07) ; v1(74.17,22.35) 73.15,23.37 H3.1 H3.2 H3.3 H3.4 H3.5 H3.6 72.14,36.83 70.61,38.35 66.68,38.35 64.52,36.19 64.52,29.08 61.72,26.29 U14.56
  Bottom Layer w0.762: v1(74.17,22.35) 74.29,22.22 v1(74.29,19.94) ; v1(53.85,26.16) 57.53,26.16 U14.55 U14.56 ; v1(18.8,20.07) v1(22.99,20.07)
+5V: length 252.9
  Top Layer w0.508: v1(76.33,15.24) 76.37,15.24 USB1.1 ; C5.1 55.37,8.89 v1(55.5,9.02) ; 52.38,20.18 R3.1
  Top Layer w0.762: 88.92,12.95 90.62,12.95 C49.1
  Top Layer w1.27: v1(72.9,15.88) 72.9,12.06 72.04,11.21 C25.2 ; U14.57 U14.58 ; v1(77.98,22.35) 90.3,22.35 92.71,19.94 92.71,14.42 C49.1 ; v1(77.98,22.35) 77.09,23.24 H4.1 H4.2 H4.3 H4.6 ; v1(77.98,22.35) 96.65,41.02 96.65,80.01 U18.2 ; v1(53.97,21.72) 53.91,21.72 C9.2
  Bottom Layer w0.508: v1(55.5,9.02) 58.29,11.81 58.29,17.4 v1(53.97,21.72) ; v1(72.9,15.88) 75.69,15.88 v1(76.33,15.24)
  Bottom Layer w0.762: v1(53.97,21.72) 53.59,22.1 17.65,22.1 15.37,24.38 15.37,49.53 7.11,57.78 3.43,57.78
  Bottom Layer w1.27: v1(77.98,22.35) 77.98,20.96 v1(72.9,15.88) ; U14.57 56.01,23.75 v1(53.97,21.72)
GND: length 128.6
  Top Layer w0.254: v1(51.69,1.91) 52.78,1.91 C7.2 ; 97.29,25.81 97.41,25.68 ; 97.41,25.68 97.41,27.47 SW2.2 ; 97.41,25.68 v1(97.41,24.64) ; v1(52.71,13.21) 52.59,13.09 U2.4 ; U29.3 85.34,14.35 v1(85.47,14.22) ; v1(88.14,7.62) 88.14,6.52 USB1.5 ; v1(65.66,69.6) C51.2 65.96,68.94 CN8.2 ; v1(92.33,6.48) 92.61,6.48 LED6.1 93.38,5.71 LED5.1 ; R7.2 36.96,14.85 v1(36.96,16.13) ; C26.1 77.34,12.57 v1(77.09,12.83) ; CN5.2 86.06,61.53 C55.2 v1(81.53,62.86) ; v1(49.91,2.03) 49.9,2.02 C3.2 ; CN7.2 85.81,41.97 C57.2 81.41,43.43 v1(81.66,43.69) ; CN6.2 82.85,52.43 C56.2 v1(81.91,53.47) ; v1(55.88,18.54) 55.13,19.3 R4.1 ; CN3.2 71.55,49.81 C53.2 65.02,49.94 v1(65.02,51.05) ; C49.2 92.52,11.24 v1(92.71,11.05) ; C1.1 v1(50.29,9.02) ; C50.2 85.22,19.88 v1(85.22,21.08) ; U18.1 93.09,80.52 v1(90.04,80.52) ; v1(73.91,8.89) 73.88,8.92 72.85,8.92 ; CN4.2 84.92,69.28 C54.2 v1(81.79,70.36) ; 66.31,1.28 70.25,1.28 LED4.1 v1(70.27,2.54) ; CN2.2 71.61,58.8 C52.2 v1(65.6,59.69) ; C2.2 v1(50.04,5.46) ; H2.1 H2.2 H2.3 H2.4 H2.5 H2.6 v1(66.42,36.07) ; C5.2 v1(51.69,8.89) ; C4.1 v1(38.99,18.29) ; C6.2 v1(51.69,5.59) ; v1(4.44,17.65) 4.32,17.53 H1.3
  Top Layer w1.27: v1(26.54,12.95) 27.43,12.06 D1.2
  Top Layer w2.286: P1.1 v1(16.67,12.95)
  Bottom Layer w0.254: v1(4.7,52.83) 4.57,52.7 CN1.3 ; v1(17.78,26.03) 19.56,26.03 U1.55 U1.56 U1.58 U1.57
1_RX: length 56.2
  Top Layer w0.254: U14.43 55.63,39.5 55.63,22.35 57.02,20.96 82.8,20.96 84.47,19.29 84.47,19.25 84.64,19.08 84.68,19.08 88.14,15.62 U29.7
1_TX: length 62.9
  Top Layer w0.254: U14.44 59.69,41.53 58.29,42.93 57.4,42.93 54.99,40.51 54.99,22.22 56.64,20.57 82.63,20.57 87.86,15.34 87.86,14.5 88.01,14.35 U29.6
2_RX: length 79.5
  Top Layer w0.254: H1.2 15.62,14.99 v1(26.92,26.29) ; U1.18 26.92,69.72 v1(26.92,43.94)
  Bottom Layer w0.254: v1(26.92,26.29) v1(26.92,43.94)
2_TX: length 89.7
  Top Layer w0.254: v1(28,44.2) 28,76.26 U1.12 ; H1.1 13.72,12.45 26.67,25.4 27.05,25.4 28,26.35 v1(28,28.45)
  Bottom Layer w0.254: v1(28,28.45) v1(28,44.2)
A1: length 17.5
  Top Layer w0.254: U1.9 19.56,84.58 16.76,81.78 16.76,79.76 12.45,75.44 10.67,75.44 9.91,74.68 H10.1
A8: length 72.8
  Top Layer w0.254: v1(55.88,45.34) 58.93,45.34 U14.42 ; H10.2 7.49,76.83 6.22,75.56 6.22,73.15 6.48,72.9 13.21,72.9 v1(15.88,75.56)
  Bottom Layer w0.254: v1(55.88,45.34) 25.65,75.56 v1(15.88,75.56)
A11: length 86.9
  Top Layer w0.254: v1(51.44,51.56) 51.44,33.66 v1(53.34,31.75) ; H10.3 9.27,79.76 10.8,78.23 v1(13.84,78.23) ; U14.54 58.93,30.1 v1(56.9,30.1)
  Bottom Layer w0.254: v1(56.9,30.1) 54.99,30.1 v1(53.34,31.75) ; v1(51.44,51.56) 51.44,55.5 28.32,78.61 28.07,78.61 27.69,78.23 v1(13.84,78.23)
A12: length 86.4
  Top Layer w0.254: H10.4 9.02,80.77 v1(14.99,80.77) ; v1(52.58,50.17) 52.58,33.78 54.23,32.13 v1(54.23,29.84)
  Bottom Layer w0.254: v1(14.99,80.77) 27.31,80.77 52.58,55.5 v1(52.58,50.17) ; U14.53 55.25,28.83 v1(54.23,29.84)
A15: length 51
  Top Layer w0.254: H10.5 10.03,84.84 10.92,85.72 56.64,85.72 U14.9
B0: length 23.1
  Top Layer w0.254: H10.6 8.13,87.38 v1(9.27,86.23) ; v1(18.54,76.2) 18.92,76.2 19.24,75.88 20.13,75.88 20.45,76.2 21.46,76.2 U1.16
  Bottom Layer w0.254: v1(9.27,86.23) 10.54,84.96 10.54,83.69 11.18,83.06 12.19,83.06 13.08,82.17 13.08,77.98 14.86,76.2 v1(18.54,76.2)
B1: length 17.4
  Top Layer w0.254: H10.7 9.14,88.27 12.45,88.27 13.21,87.5 v1(13.21,86.49) ; U1.13 v1(17.78,81.41)
  Bottom Layer w0.254: v1(13.21,86.49) 13.21,85.98 v1(17.78,81.41)
B2: length 40
  Top Layer w0.254: v1(14.1,67.56) 16,67.56 v1(16.38,67.18) ; H10.8 6.22,91.19 6.22,76.07 5.84,75.69 5.84,73.03 v1(9.84,69.03)
  Bottom Layer w0.254: U1.24 21.08,65.66 17.91,65.66 v1(16.38,67.18) ; v1(14.1,67.56) 11.31,67.56 v1(9.84,69.03)
B10: length 55.4
  Top Layer w0.254: H10.9 7.49,94.05 5.49,92.05 5.49,72.88 7.49,70.88 7.49,68.2 v1(8.13,67.56) ; v1(17.27,56.01) 17.27,51.18 18.16,50.29 20.95,50.29 U1.38
  Bottom Layer w0.254: v1(17.27,56.01) 8.13,65.15 v1(8.13,67.56)
B11: length 58.4
  Top Layer w0.254: U1.39 16,50.17 v1(16,55.63) ; H10.10 5.13,95.17 5.13,72.59 6.98,70.74 v1(6.98,66.93)
  Bottom Layer w0.254: v1(16,55.63) 16,56.01 11.68,60.33 11.05,60.33 6.98,64.39 v1(6.98,66.93)
B12: length 44.7
  Top Layer w0.254: v1(17.14,39.5) 17.78,38.86 U1.45 ; H11.1 v1(3.17,62.23)
  Bottom Layer w0.254: v1(17.14,39.5) 17.14,50.8 9.14,58.8 6.6,58.8 v1(3.17,62.23)
B13: length 60.5
  Top Layer w0.254: v1(13.72,45.72) 14.22,45.21 23.62,45.21 24.26,44.58 24.26,40.89 U1.46 ; H11.2 1.52,75.06 1.52,61.85 v1(1.78,61.59)
  Bottom Layer w0.254: v1(1.78,61.59) 1.78,60.87 1.84,60.81 1.84,60.32 1.78,60.26 1.78,47.12 3.17,45.72 v1(13.72,45.72)
B14: length 60.5
  Top Layer w0.254: v1(13.97,44.58) 16.26,44.58 v1(16.51,44.32) ; v1(1.26,60.57) 0.99,60.83 0.99,77.06 H11.3
  Bottom Layer w0.254: v1(1.26,60.57) 1.26,46.75 3.43,44.58 v1(13.97,44.58) ; v1(16.51,44.32) 16.51,37.08 17.27,36.32 U1.47
B15: length 64.7
  Top Layer w0.254: U1.48 20.95,37.59 20.95,42.16 20.57,42.55 18.92,42.55 17.91,43.56 v1(14.22,43.56) ; H11.4 0.61,79.22 v1(0.61,46.74)
  Bottom Layer w0.254: v1(14.22,43.56) 3.78,43.56 v1(0.61,46.74)
C0: length 22.1
  Bottom Layer w0.254: H11.5 6.22,87.38 6.22,90.93 6.4,91.11 10.87,91.11 11.18,90.81 18.29,90.81 U1.3
C1: length 24.6
  Bottom Layer w0.254: H11.6 4.57,88.27 4.57,91.82 6.48,93.73 10.16,93.73 10.54,93.34 21.08,93.34 U1.4
C2: length 32
  Top Layer w0.254: H11.7 1.55,91.03 1.55,97.5 3.42,99.38 18.73,99.38 v1(19.94,98.17)
  Bottom Layer w0.254: U1.1 19.94,95 v1(19.94,98.17)
C3: length 28.7
  Top Layer w0.254: U1.2 17.95,99.02 3.57,99.02 1.91,97.35 1.91,93.22 H11.8
C4: length 39.6
  Top Layer w0.254: U1.21 19.05,69.98 v1(19.05,70.48) ; v1(5.21,71.37) 4.77,71.81 4.77,92.89 H11.9
  Bottom Layer w0.254: v1(5.21,71.37) 15.62,71.37 16.51,70.48 v1(19.05,70.48)
C5: length 35.5
  Top Layer w0.254: H11.10 4.83,97.03 6.46,98.66 13.09,98.66 16.13,95.63 v1(16.13,86.49) ; U1.15 19.69,77.34 v1(18.16,78.87) ; v1(16.13,80.14) v1(16.13,84.2)
  Bottom Layer w0.254: v1(16.13,86.49) v1(16.13,84.2) ; v1(18.16,78.87) 17.4,78.87 v1(16.13,80.14)
DIR1: length 59.7
  Top Layer w0.254: v1(25.22,40.21) 50.79,65.79 58.8,65.79 U14.26 ; U17.1 v1(17.78,40.29)
  Bottom Layer w0.254: v1(25.22,40.21) 25.11,40.1 17.97,40.1 v1(17.78,40.29)
DIR2: length 57
  Top Layer w0.254: U17.2 v1(17.78,37.79) ; v1(25.35,37.59) 52.15,64.39 U14.25
  Bottom Layer w0.254: v1(25.35,37.59) 23.78,37.59 23.64,37.72 20.87,37.72 20.81,37.78 17.91,37.78 17.91,37.79 v1(17.78,37.79)
DIR3: length 65.9
  Top Layer w0.254: U14.24 61.85,65.28 61.85,63.5 61.34,62.99 52.87,62.99 v1(25.09,35.21) ; U17.3 v1(17.78,35.29)
  Bottom Layer w0.254: v1(25.09,35.21) 22.49,35.21 22.48,35.22 19.7,35.22 19.69,35.24 17.82,35.24 v1(17.78,35.29)
DIR4: length 64.4
  Top Layer w0.254: v1(53.34,62.36) 53.34,60.96 v1(25.09,32.71) ; U17.4 v1(17.78,32.79) ; U14.21 56.26,69.47 v1(53.34,66.55)
  Bottom Layer w0.254: v1(17.78,32.79) 17.86,32.7 22.67,32.7 22.68,32.71 v1(25.09,32.71) ; v1(53.34,62.36) v1(53.34,66.55)
DIR5: length 60.4
  Top Layer w0.254: v1(24.97,30.21) 52.67,57.91 58.29,57.91 59.44,56.77 U14.32 ; U17.5 v1(17.78,30.29)
  Bottom Layer w0.254: v1(17.78,30.29) 17.9,30.16 23.47,30.16 23.52,30.21 v1(24.97,30.21)
DIR6: length 56.9
  Top Layer w0.254: U17.6 v1(17.78,27.79) ; v1(25.09,27.71) 26.44,27.71 52.96,54.23 U14.33
  Bottom Layer w0.254: v1(25.09,27.71) 25.01,27.62 17.94,27.62 v1(17.78,27.79)
HAND: length 24.6
  Top Layer w0.254: U1.22 20.83,67.94 18.92,67.94 6.22,55.25 CN1.2
IIC1_SCL: length 43.5
  Top Layer w0.254: U14.23 58.8,68.07 60.33,68.07 61.85,69.6 v1(62.1,69.6) ; U18.3 77.72,70.23 v1(65.15,70.23)
  Bottom Layer w0.254: v1(65.15,70.23) 64.52,69.6 v1(62.1,69.6)
IIC1_SDA: length 41
  Top Layer w0.254: v1(65.02,71.37) 76.33,71.37 U18.4 ; U14.22 60.45,69.47 v1(61.85,70.87)
  Bottom Layer w0.254: v1(61.85,70.87) 62.36,71.37 v1(65.02,71.37)
JOINT1: length 40
  Top Layer w0.254: v1(5.97,32.13) 5.97,30.07 U16.1 ; v1(5.97,34.8) 5.97,38.73 9.53,42.29 9.53,54.48 11.68,56.64 U1.31
  Bottom Layer w0.254: v1(5.97,32.13) v1(5.97,34.8)
JOINT2: length 56.9
  Top Layer w0.254: U1.20 21.08,73.03 19.11,73.03 v1(18.19,72.1) ; v1(14.86,72.01) 13.84,72.01 1.55,59.72 1.55,33.65 3.81,31.39 U16.2
  Bottom Layer w0.254: v1(18.19,72.1) 18.1,72.01 v1(14.86,72.01)
JOINT3: length 52
  Top Layer w0.254: U16.3 1.91,34.82 1.91,59.06 2.67,59.82 10.29,59.82 18.29,67.82 18.29,71.12 19.05,71.88 U1.19
JOINT4: length 18.7
  Top Layer w0.254: U16.4 10.27,28.96 19.43,28.96 U1.53
JOINT5: length 55.6
  Top Layer w0.254: v1(15.11,63.25) 15.11,61.21 8.89,54.99 8.89,42.99 U16.5 ; v1(15.11,70.74) 17.14,72.77 17.14,81.66 18.61,83.12 20.76,83.12 U1.10
  Bottom Layer w0.254: v1(15.11,63.25) v1(15.11,70.74)
JOINT6: length 41
  Top Layer w0.254: v1(13.97,61.85) 13.97,61.21 7.75,54.99 7.75,44.35 U16.6 ; v1(13.97,64.39) 13.46,64.9 13.46,68.2 U1.17
  Bottom Layer w0.254: v1(13.97,61.85) v1(13.97,64.39)
K1: length 19.7
  Top Layer w0.254: CN8.1 72.09,67.25 C51.1 64.13,68.77 64.13,73.15 U14.16
K2: length 31.2
  Top Layer w0.254: U14.15 58.93,75.82 60.71,75.82 62.74,73.79 62.74,60.26 C52.1 65.66,57.46 CN2.1
K3: length 23.3
  Top Layer w0.254: CN3.1 65.02,48.53 C53.1 63.5,49.8 63.5,58.55 U14.28
K4: length 32.9
  Top Layer w0.254: U14.29 57.66,59.18 58.67,58.17 v1(62.61,58.17) ; v1(66.68,61.98) 67.94,63.25 77.15,63.25 C54.1 81.79,67.88 86.01,67.88
  Bottom Layer w0.254: v1(66.68,61.98) 62.87,58.17 v1(62.61,58.17)
K5: length 28.4
  Top Layer w0.254: v1(63.75,60.33) 70.74,60.33 72.52,62.1 79.56,62.1 C55.1 85.3,60.13 CN5.1 ; U14.30 v1(61.59,59.31)
  Bottom Layer w0.254: v1(63.75,60.33) 62.74,59.31 v1(61.59,59.31)
K6: length 31.7
  Top Layer w0.254: v1(64.13,54.36) 77.66,54.36 C56.1 82.21,49.8 86.23,49.8 ; U14.31 57.66,56.39 58.55,55.5 61.72,55.5 v1(62.74,54.48)
  Bottom Layer w0.254: v1(64.13,54.36) 62.87,54.36 v1(62.74,54.48)
K_HAND: length 34.7
  Top Layer w0.254: U14.34 62.87,51.56 62.87,46.86 69.15,40.58 C57.1 85.56,40.58 CN7.1
KEY1: length 119
  Top Layer w0.254: v1(62.1,72.77) 61.21,72.77 60.51,73.47 59.75,73.47 58.67,74.55 U14.17 ; C58.1 95.01,25.81 SW2.1 92.01,33.21 98.81,40 98.81,85.34 92.84,91.31 90.68,91.31 89.28,89.92 89.28,85.85 76.07,72.64 v1(65.02,72.64)
  Bottom Layer w0.254: v1(65.02,72.64) 64.9,72.77 v1(62.1,72.77)
LED1: length 137.5
  Top Layer w0.254: 94.86,5.84 94.86,5.84 v1(97.28,5.84) ; U14.20 v1(62.1,72.01) ; v1(74.68,74.17) 88.01,87.5 88.01,91.31 89.53,92.84 92.32,92.84 99.54,85.62 99.54,84.99 99.57,84.96 99.57,6.1 v1(99.31,5.84)
  Bottom Layer w0.254: v1(74.68,74.17) 72.52,72.01 v1(62.1,72.01) ; v1(99.31,5.84) v1(97.28,5.84)
LED2: length 137.1
  Top Layer w0.254: v1(61.34,73.91) 60.71,74.55 U14.18 ; LED5.2 99.19,6.61 99.19,85.47 92.58,92.08 90.17,92.08 88.52,90.42 88.52,86.36 75.56,73.41 v1(65.15,73.41)
  Bottom Layer w0.254: v1(61.34,73.91) 61.85,73.41 v1(65.15,73.41)
USB2_D+: length 12.7
  Top Layer w0.254: 83.55,16.76 85.16,16.76 86.61,15.31 USB1.3
USB2_D-: length 12.7
  Top Layer w0.254: 83.55,15.49 82.17,15.49 81.91,15.24 81.91,11.43 84.58,8.76 85.22,8.76 85.84,8.14 85.84,6.42 USB1.2
$1N3596: length 4
  Top Layer w0.254: C50.1 89.04,17.32 U29.8
$2N769: length 8
  Top Layer w0.381: U2.6 51.12,14.68 50.33,13.88 49.48,13.88 49.43,13.83 R1.2
$2N774: length 12.7
  Top Layer w0.381: C4.2 41.2,15.3 R6.2 46.24,14.98 46.74,14.48 50.04,14.48 50.47,14.91 U2.7
$2N775: length 9
  Top Layer w0.381: C8.2 58.23,13.78 57.28,12.83 54.36,12.83 53.09,14.1 51.56,14.1 51.12,13.66 U2.3
$2N780: length 4.2
  Top Layer w0.381: R2.1 55.75,15.61 U2.5
$2N781: length 3
  Top Layer w0.381: C8.1 57.22,13.98 R2.2
$2N783: length 4.3
  Top Layer w0.381: 49.82,15.61 49.82,16.47 48.89,17.41 R5.2
$2N784: length 8.7
  Top Layer w0.381: R5.1 46.97,18.68 R3.2 52.27,18.68 C9.1 53.54,18.99 R4.2
$2N785: length 13.3
  Top Layer w0.381: R7.1 37.08,13.47 R6.1 43.49,13.47 43.88,13.09 44.19,13.09 44.2,13.08 49.81,13.08 49.82,13.09
$2N1147: length 2.3
  Top Layer w0.254: 71.87,1.26 74.17,1.26 R24.1
$2N2263: length 2
  Top Layer w0.254: R9.1 64.58,1.4 LED7.2

## Copper pours and planes (outline as drawn; the poured copper is in the pictures)
3.3V on Top Layer: 74.28,9.54 74.42,9.4 76.35,9.4 76.33,9.4 76.33,3.56 75.06,2.29 75.06,0.08 77.16,0.08 78.49,1.4 78.49,10.29 74.28,10.29
5V on Top Layer: 71.88,10.3 72.99,10.3 73.34,9.95 73.34,7.68 73.28,7.62 72.64,7.62 71.88,8.38
12V_IN on Top Layer: 18.93,7.99 18.93,0 19.05,-0.13 19.18,0 28.14,0 28.14,6.78 26.94,7.99
12V_OUT on Top Layer: 29.59,0.13 29.59,9.65 30.99,11.05 30.99,12.45 31.88,13.34 33.91,13.34 35.05,12.19 40.26,12.19 41.4,11.05 42.5,11.05 43.34,11.89 43.34,12.48 43.69,12.83 45.21,12.83 46.35,11.68 49.78,11.68 50.29,12.19 50.29,13.54 50.62,13.54 50.67,13.59 50.67,11.45 49.48,10.25 48.52,10.25 48.39,10.12 48.35,10.12 48.26,10.03 48.26,0.54 47.72,0 29.72,0
+5V on Top Layer: 60.96,9.14 66.28,9.14 68.76,11.63 71.96,11.63 73.52,10.07 73.52,9.64 73.41,9.53 72.14,9.53 72.14,8.25 73.34,8.25 73.34,7.82 73.41,7.75 72.64,7.75 70.99,6.1 62.23,6.1 60.96,7.37
+5V on Top Layer: 53.79,0 53.79,4.76 53.59,4.95 53.59,8.25 53.47,8.38 53.47,9.53 53.97,10.03 59.94,10.03 60.71,9.27 63.88,9.27 64.13,9.02 64.13,6.04 61.55,3.45 61.55,2.46 61.72,2.29 61.72,0.55 61.17,0
GND on Top Layer: -17.91,123.57 113.79,123.57 113.79,-10.03 -17.91,-10.03
GND on Top Layer: 48.52,0 48.52,9.43 48.81,9.72 50.11,9.72 51.56,11.18 51.56,13.61 52.42,13.61 53.22,12.81 53.22,3.29 53.34,3.18 53.34,0.1 53.24,0
GND on Bottom Layer: -5.97,112.27 104.9,112.27 104.9,-6.22 -5.97,-6.22
$2N775 on Top Layer: 58.02,14.2 58.02,10.94 58.04,10.92 64.01,10.92 64.26,11.18 64.26,13.59 64.39,13.72 63.91,14.2

Small or netless copper shapes (teardrops, artwork), in the pictures only: 327 on Top Layer, 98 on Bottom Layer

## Text on the board
Top Silkscreen Layer: GND 3V3 5V | K2 | K3 | K1 | K_HAND | K5 | K6 | K4 | ON OFF | + -
